# Altium project BLAX_PROD_01_STD_1370_V01.PrjPcb (part 1 of 2)
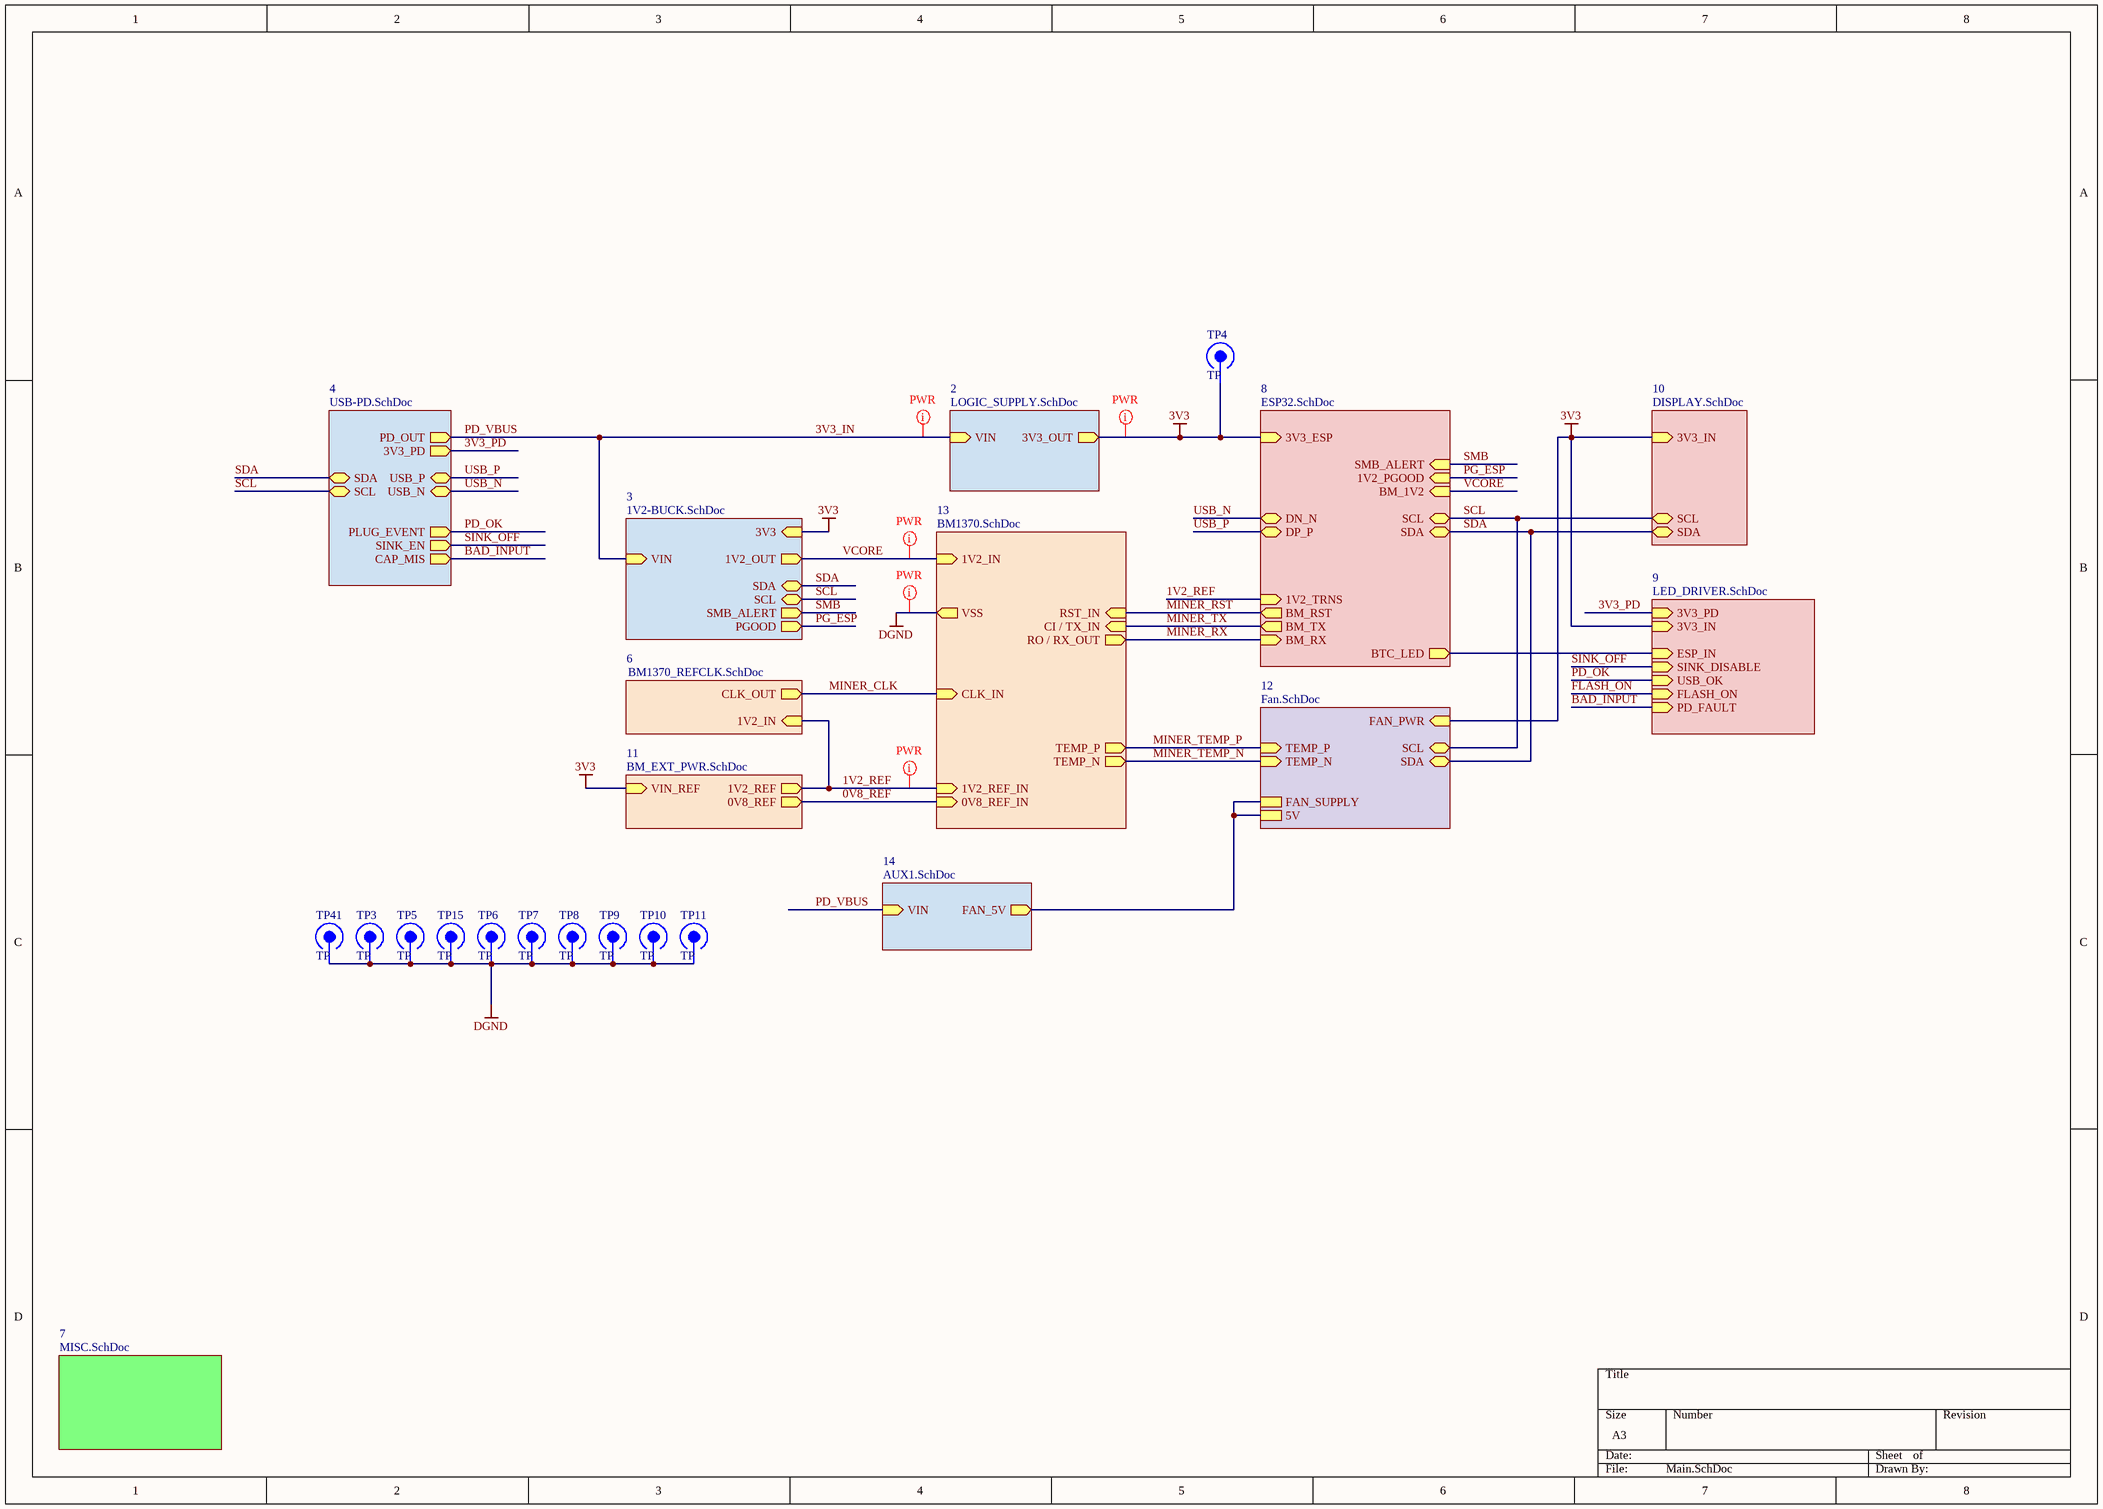
[diagram p0: Main.SchDoc]
13 sheets, 238 parts. Net scope: hierarchical (ports join the sheet entries above them; power ports are global).
Board files: BLU_AX_V1_1_1.PcbDoc, BLU_AX_V1_1_1_FRAME.PcbDoc
Sheets:
  Main.SchDoc
    3 = 1V2-BUCK.SchDoc
    13 = BM1370.SchDoc
    12 = Fan.SchDoc
    4 = USB-PD.SchDoc
    11 = BM_EXT_PWR.SchDoc
    6 = BM1370_REFCLK.SchDoc
    8 = ESP32.SchDoc
    7 = MISC.SchDoc
    2 = LOGIC_SUPPLY.SchDoc
    10 = DISPLAY.SchDoc
    9 = LED_DRIVER.SchDoc
    14 = AUX1.SchDoc

## Sheet Main.SchDoc
size A3; SheetNumber: 1; SheetTotal: 17

### Parts
TP3  TP  [TP-Footprint-1]
TP4  TP  [TP-Footprint-1]
TP5  TP  [TP-Footprint-1]
TP6  TP  [TP-Footprint-1]
TP7  TP  [TP-Footprint-1]
TP8  TP  [TP-Footprint-1]
TP9  TP  [TP-Footprint-1]
TP10  TP  [TP-Footprint-1]
TP11  TP  [TP-Footprint-1]
TP15  TP  [TP-Footprint-1]
TP41  TP  [TP-Footprint-1]

### Sub-sheets
2 = LOGIC_SUPPLY.SchDoc: VIN (in), 3V3_OUT (out)
3 = 1V2-BUCK.SchDoc: VIN (in), 1V2_OUT (out), SDA (bidir), SCL (bidir), SMB_ALERT (out), 3V3 (in), PGOOD (out)
4 = USB-PD.SchDoc: PD_OUT (out), USB_P (bidir), USB_N (bidir), PLUG_EVENT (out), SINK_EN (out), CAP_MIS (out), SDA (bidir), SCL (bidir), 3V3_PD (out)
6 = BM1370_REFCLK.SchDoc: 1V2_IN (in), CLK_OUT (out)
7 = MISC.SchDoc: no entries
8 = ESP32.SchDoc: 3V3_ESP (in), DN_N (bidir), DP_P (bidir), 1V2_PGOOD (in), BM_1V2 (in), SCL (bidir), SDA (bidir), 1V2_TRNS (in), BM_RST (out), BM_TX (out), BM_RX (in), BTC_LED (out), SMB_ALERT (in)
9 = LED_DRIVER.SchDoc: 3V3_IN (in), ESP_IN (in), SINK_DISABLE (in), USB_OK (in), FLASH_ON (in), PD_FAULT (in), 3V3_PD (in)
10 = DISPLAY.SchDoc: 3V3_IN (in), SCL (bidir), SDA (bidir)
11 = BM_EXT_PWR.SchDoc: VIN_REF (in), 1V2_REF (out), 0V8_REF (out)
12 = Fan.SchDoc: SCL (bidir), SDA (bidir), TEMP_P (in), TEMP_N (in), FAN_PWR (in), FAN_SUPPLY, 5V
13 = BM1370.SchDoc: 1V2_REF_IN (in), 0V8_REF_IN (in), 1V2_IN (in), VSS (out), RST_IN (in), CI / TX_IN (in), RO / RX_OUT (out), TEMP_P (out), TEMP_N (out), CLK_IN (in)
14 = AUX1.SchDoc: VIN (in), FAN_5V (out)

### Nets
3V3: TP4.1 ; sheet 3/3V3, sheet 12/FAN_PWR, sheet 11/VIN_REF, sheet 8/3V3_ESP, sheet 2/3V3_OUT, sheet 10/3V3_IN, sheet 9/3V3_IN  [project net 3V3_ESP]
3V3_PD: sheet 4/3V3_PD, sheet 9/3V3_PD
DGND: TP3.1 TP5.1 TP6.1 TP7.1 TP8.1 TP9.1 TP10.1 TP11.1 TP15.1 TP41.1 ; sheet 13/VSS
0V8_REF: sheet 13/0V8_REF_IN, sheet 11/0V8_REF
1V2_REF: sheet 13/1V2_REF_IN, sheet 11/1V2_REF, sheet 6/1V2_IN, sheet 8/1V2_TRNS  [project net 1V2]
3V3_IN: sheet 3/VIN, sheet 4/PD_OUT, sheet 2/VIN, sheet 14/VIN  [also labelled PD_VBUS]
BAD_INPUT: sheet 4/CAP_MIS, sheet 9/PD_FAULT
FLASH_ON: sheet 9/FLASH_ON
FS: sheet 12/FAN_SUPPLY, sheet 12/5V, sheet 14/FAN_5V
MINER_CLK: sheet 13/CLK_IN, sheet 6/CLK_OUT
MINER_RST: sheet 13/RST_IN, sheet 8/BM_RST
MINER_RX: sheet 13/RO / RX_OUT, sheet 8/BM_RX
MINER_TEMP_N: sheet 13/TEMP_N, sheet 12/TEMP_N
MINER_TEMP_P: sheet 13/TEMP_P, sheet 12/TEMP_P
MINER_TX: sheet 13/CI / TX_IN, sheet 8/BM_TX
PD_OK: sheet 4/PLUG_EVENT, sheet 9/USB_OK
PG_ESP: sheet 3/PGOOD, sheet 8/1V2_PGOOD
SCL: sheet 3/SCL, sheet 12/SCL, sheet 4/SCL, sheet 8/SCL, sheet 10/SCL
SDA: sheet 3/SDA, sheet 12/SDA, sheet 4/SDA, sheet 8/SDA, sheet 10/SDA
SINK_OFF: sheet 4/SINK_EN, sheet 9/SINK_DISABLE  [project net SINK_EN]
SMB: sheet 3/SMB_ALERT, sheet 8/SMB_ALERT
USB_N: sheet 4/USB_N, sheet 8/DN_N
USB_P: sheet 4/USB_P, sheet 8/DP_P
VCORE: sheet 3/1V2_OUT, sheet 13/1V2_IN, sheet 8/BM_1V2
NetU5_23: sheet 8/BTC_LED, sheet 9/ESP_IN

### Layout directives
net class PWR: 1V2, 3V3_ESP, 3V3_IN, DGND, VCORE

### Library data of the parts
TP3-TP11 TP15 TP41 = CMP-001-0086-4: digital shovel test point

## Sheet 1V2-BUCK.SchDoc
size A2; SheetNumber: 5; SheetTotal: 17
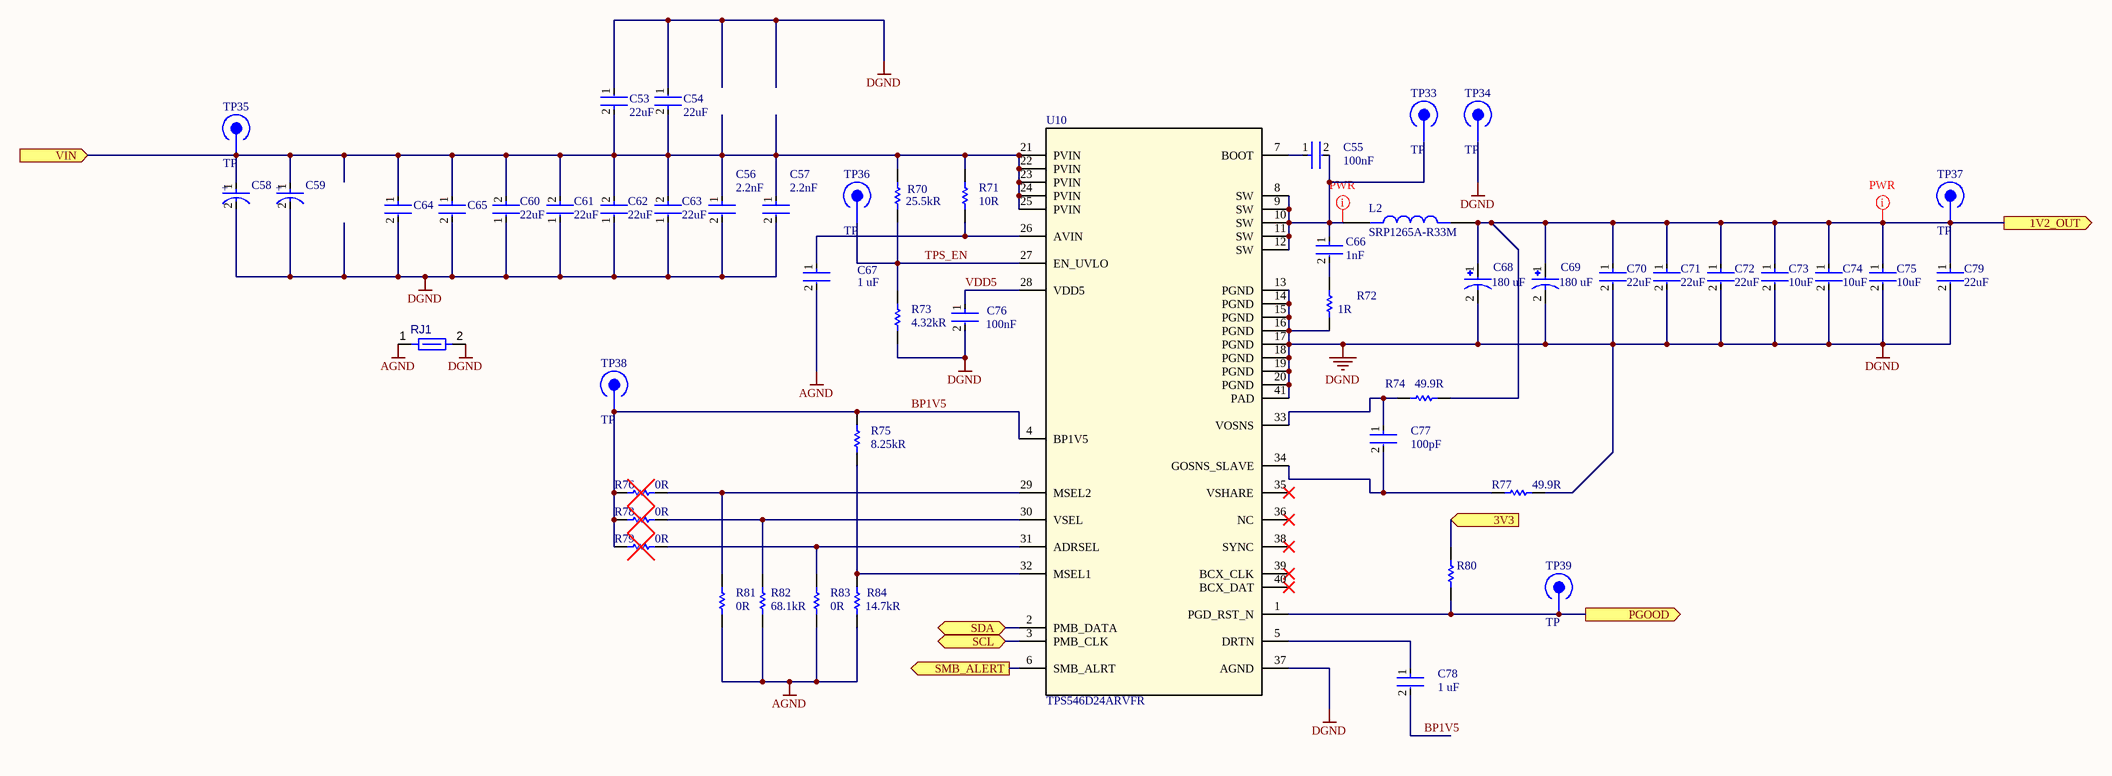
[diagram p1: 1V2-BUCK.SchDoc]

### Parts
C53  Capacitance: 22uF  [FP-GRM31C-0_3-e0_3_0_8-MFG]  (hidden comment: GRM31CC81E226ME11L)
C54  Capacitance: 22uF  [FP-GRM31C-0_3-e0_3_0_8-MFG]  (hidden comment: GRM31CC81E226ME11L)
C55  value 100nF  [FP-CC0402-IPC_B]  (hidden comment: CC0402KRX7R9BB104)
C56  value 2.2nF  [FP-CC0402-MFG]  (hidden comment: CC0402KRX7R8BB222)
C57  value 2.2nF  [FP-CC0402-MFG]  (hidden comment: CC0402KRX7R8BB222)
C58  593D107X9020E2TE3  [593D107X9020E2TE3-Footprint-1]  (value not drawn)
C59  593D107X9020E2TE3  [593D107X9020E2TE3-Footprint-1]  (value not drawn)
C60  Capacitance: 22uF  [FP-GRM31C-0_3-e0_3_0_8-MFG]  (hidden comment: GRM31CC81E226ME11L)
C61  Capacitance: 22uF  [FP-GRM31C-0_3-e0_3_0_8-MFG]  (hidden comment: GRM31CC81E226ME11L)
C62  Capacitance: 22uF  [FP-GRM31C-0_3-e0_3_0_8-MFG]  (hidden comment: GRM31CC81E226ME11L)
C63  Capacitance: 22uF  [FP-GRM31C-0_3-e0_3_0_8-MFG]  (hidden comment: GRM31CC81E226ME11L)
C64  C3216X5R1E476M160AC  [FP-C3216-160-0_2-MFG]  (value not drawn)
C65  C3216X5R1E476M160AC  [FP-C3216-160-0_2-MFG]  (value not drawn)
C66  value 1nF  [FP-CC0805-0_85-MFG]  (hidden comment: CC0805KRX7R9BB102)
C67  value 1 uF  [FP-CC0402-MFG]  (hidden comment: CC0402KRX5R6BB105)
C68  value 180 uF  [EEF-SX0J181ER-Footprint-1]  (hidden comment: EEF-SX0J181ER)
C69  value 180 uF  [EEF-SX0J181ER-Footprint-1]  (hidden comment: EEF-SX0J181ER)
C70  value 22uF  [FP-GRM21B-0_2-e0_2_0_7-MFG]  (hidden comment: GRM21BZ70J226ME44L)
C71  value 22uF  [FP-GRM21B-0_2-e0_2_0_7-MFG]  (hidden comment: GRM21BZ70J226ME44L)
C72  value 22uF  [FP-GRM21B-0_2-e0_2_0_7-MFG]  (hidden comment: GRM21BZ70J226ME44L)
C73  value 10uF  [FP-GRM21B-0_15-MFG]  (hidden comment: GRM21BR71A106KA73L)
C74  value 10uF  [FP-GRM21B-0_15-MFG]  (hidden comment: GRM21BR71A106KA73L)
C75  value 10uF  [FP-GRM21B-0_15-MFG]  (hidden comment: GRM21BR71A106KA73L)
C76  value 100nF  [FP-CC0402-IPC_B]  (hidden comment: CC0402KRX7R9BB104)
C77  value 100pF  [FP-CC0402-MFG]  (hidden comment: CC0402KRX7R9BB101)
C78  value 1 uF  [FP-CC0402-MFG]  (hidden comment: CC0402KRX5R6BB105)
C79  value 22uF  [FP-GRM21B-0_2-e0_2_0_7-MFG]  (hidden comment: GRM21BZ70J226ME44L)
L2  SRP1265A-R33M  [SRP1265A-R33M]
R70  value 25.5kR  [RESC1005X40X25LL10T10]  (hidden comment: RK73H1ETTP2552F)
R71  value 10R  [RESC1005X40X25LL10T10]  (hidden comment: RK73H1ETTP10R0F)
R72  value 1R  [FP-RK73H2E-MFG]  (hidden comment: RK73H2ETTD1R00F)
R73  value 4.32kR  [RESC1005X40X25ML10T10]  (hidden comment: RK73H1ETTP4321F)
R74  value 49.9R  [RESC1005X40X25LL10T10]  (hidden comment: RK73H1ETTP49R9F)
R75  value 8.25kR  [RESC1005X40X25NL10T10]  (hidden comment: RK73H1ETTP8251F)
R76  value 0R  [FP-RK73Z1E-IPC_B]  (hidden comment: RK73Z1ETTP)  (no BOM)
R77  value 49.9R  [RESC1005X40X25LL10T10]  (hidden comment: RK73H1ETTP49R9F)
R78  value 0R  [FP-RK73Z1E-IPC_B]  (hidden comment: RK73Z1ETTP)  (no BOM)
R79  value 0R  [FP-RK73Z1E-IPC_B]  (hidden comment: RK73Z1ETTP)  (no BOM)
R80  RK73H1ETTP1002F  [RESC1005X40X25LL10T10]  (value not drawn)
R81  value 0R  [FP-RK73Z1E-IPC_B]  (hidden comment: RK73Z1ETTP)
R82  value 68.1kR  [RESC1005X40X25LL10T10]  (hidden comment: RK73H1ETTP6812F)
R83  value 0R  [FP-RK73Z1E-IPC_B]  (hidden comment: RK73Z1ETTP)  (no BOM)
R84  value 14.7kR  [RESC1005X40X25LL10T10]  (hidden comment: RK73H1ETTP1472F)
RJ1  Net Tie 12x8mil  [SHORT06-FP]  (value not drawn)  (net tie, no BOM)
TP33  TP  [TP-Footprint-1]
TP34  TP  [TP-Footprint-1]
TP35  TP  [TP-Footprint-1]
TP36  TP  [TP-Footprint-1]
TP37  TP  [TP-Footprint-1]
TP38  TP  [TP-Footprint-1]
TP39  TP  [TP-Footprint-1]
U10  TPS546D24ARVFR  [TPS546D24ARVFR-Footprint-1]

### Ports
1V2_OUT (out), 3V3 (in), PGOOD (out), SCL (bidir), SDA (bidir), SMB_ALERT (out), VIN (in)

### Nets
3V3_ESP: R80.2 ; port 3V3
AGND: C67.2 R81.1 R82.1 R83.1 R84.1 RJ1.1
DGND: C53.1 C54.1 C56.2 C57.2 C58.2(C) C59.2(C) C60.1 C61.1 C62.1 C63.1 C64.2 C65.2 C68.2 C69.2 C70.2 C71.2 C72.2 C73.2 C74.2 C75.2 C76.2 C79.2 R72.1 R73.1 R77.2 RJ1.2 TP34.1 U10.13(PGND) U10.14(PGND) U10.15(PGND) U10.16(PGND) U10.17(PGND) U10.18(PGND) U10.19(PGND) U10.20(PGND) U10.37(AGND) U10.41(PAD)
3V3_IN: C53.2 C54.2 C56.1 C57.1 C58.1(A) C59.1(A) C60.2 C61.2 C62.2 C63.2 C64.1 C65.1 R70.2 R71.2 TP35.1 U10.21(PVIN) U10.22(PVIN) U10.23(PVIN) U10.24(PVIN) U10.25(PVIN) ; port VIN
BP1V5: C78.2 R75.1 R76.2 R78.2 R79.2 TP38.1 U10.4(BP1V5)
PG_ESP: R80.1 TP39.1 U10.1(PGD_RST_N) ; port PGOOD
SCL: U10.3(PMB_CLK) ; port SCL
SDA: U10.2(PMB_DATA) ; port SDA
SMB: U10.6(SMB_ALRT) ; port SMB_ALERT
TPS_EN: R70.1 R73.2 TP36.1 U10.27(EN_UVLO)
VCORE: C68.1 C69.1 C70.1 C71.1 C72.1 C73.1 C74.1 C75.1 C79.1 L2.2 R74.2 TP37.1 ; port 1V2_OUT
VDD5: C76.1 U10.28(VDD5)
NetC55_1: C55.1 U10.7(BOOT)
NetC55_2: C55.2 C66.1 L2.1 TP33.1 U10.8(SW) U10.9(SW) U10.10(SW) U10.11(SW) U10.12(SW)
NetC66_2: C66.2 R72.2
NetC67_1: C67.1 R71.1 U10.26(AVIN)
NetC77_1: C77.1 R74.1 U10.33(VOSNS)
NetC77_2: C77.2 R77.1 U10.34(GOSNS_SLAVE)
NetC78_1: C78.1 U10.5(DRTN)
NetR75_2: R75.2 R84.2 U10.32(MSEL1)
NetR76_1: R76.1 R81.2 U10.29(MSEL2)
NetR78_1: R78.1 R82.2 U10.30(VSEL)
NetR79_1: R79.1 R83.2 U10.31(ADRSEL)

Not connected (* = marked no-connect by the designer): U10 35(VSHARE)* 36(NC)* 38(SYNC)* 39(BCX_CLK)* 40(BCX_DAT)*

### Layout directives
net class PWR: NetC55_2, VCORE

### Notes on the sheet
- (in symbol CMP-001-00321-3) +

### Library data of the parts
C53 C54 C60-C63 = CMP-06035-043516-1: Chip Multilayer Ceramic Capacitors for General Purpose, 1206, 22uF, X6S, 22%, 20%, 25V; Width: 1.6mm; Dielectric: X6S; Thickness: 1.6mm; Length: 3.2mm; Voltage Rating (DC): 25V; Tolerance: 20%
C55 C76 = CMP-x00152-1: Ceramic Capacitor, Multilayer, Ceramic, 50V, 10% +Tol, 10% -Tol, X7R, 15% TC, 0.1uF, Surface Mount, 0402
C56 C57 = CMP-x00156-1: Ceramic Capacitor, Multilayer, Ceramic, 25V, 10% +Tol, 10% -Tol, X7R, 15% TC, 0.0022uF, Surface Mount, 0402
C58 C59 = CMP-001-00321-3: No Description Available; Mfr_Name: Vishay; Pins: 2; Design Item ID: 593D107X9020E2TE3; Source: 593D107X9020E2TE3.SchLib; Component Type: Standard
C64 C65 = CMP-2000-05397-3: Multilayer Ceramic Capacitors 47uF ±20% 25V X5R SMD 1206; Weight: 0.000571oz; Dielectric: X5R; Length: 0.126inch; Voltage Rating: 25V; Case/Package: 1206; Dielectric Material: Ceramic; Min Operating Temperature: -55°C; Lead Free: Lead Free; Packaging: Tape and Reel; Package Quantity: 1; Mount: Surface Mount; Depth: 1.6mm; REACH SVHC: No SVHC; Termination: SMD/SMT; Case Code (Imperial): 1206; Series: C; Resistor Type: Ceramic; Voltage: 25V; Width: 0.063inch; Height: 1.6mm; Tolerance: 20%; Capacitance: 47uF; Max Operating Temperature: 85°C; Voltage Rating (DC): 25V; RoHS Compliant: Yes; Thickness: 0.071inch; Case Code (Metric): 3216
C66 = CMP-x00143-1: Ceramic Capacitor, Multilayer, Ceramic, 50V, 10% +Tol, 10% -Tol, X7R, 15% TC, 0.001uF, Surface Mount, 0805; Category: Capacitor
C67 C78 = CMP-03422-000489-1: CAP CER 1UF 10V X5R 0402; Manufacturer: YAGEO; Temperature Coefficient: 30ppm/°C; Tolerance: 0.1; Automotive Grade: NA; Material: Ceramic; Device Class L1: Passive Components; Ipc Land Pattern Name: CAPC10050X50; Height: 0.55mm; Voltage Rating: 10 V; Digikey Description: CAP CER 1UF 10V X5R 0402; RoHS: TRUE; Temperature: -55°C to +125°C; Octopart: https://octopart.com/cc0402krx5r6bb105-yageo-42244620; Mouser Description: Multilayer Ceramic Capacitors MLCC - SMD/SMT 1uF 10V X5R 10%; Manufacturer Part Number: CC0402KRX5R6BB105; Temperature Characteristic: X5R; Category: Cap; Automotive: No; Temperature Range Low: -55°C; ComponentLink2Description: Datasheet; Temperature Range High: +125°C; Package: CC0402; Capacitance: 1 uF; Footprint Url: http://www.yageo.com/exep/pages/download/literatures/UPY-C_GEN_24.pdf; ComponentLink2URL: http://www.yageo.com/documents/recent/UPY-GP_NP0_16V-to-50V_16.pdf; Lead Free: Yes; Device Class L3: Ceramic Capacitors; Device Class L2: Capacitors
C68 C69 = CMP-x00146-3: Cap Aluminum Polymer 180uF 6.3VDC 20%( 7.3 X 4.3 X 1.9mm) SMD 0.009 Ohm 6300mA 2000h 105C T/R; Manufacturer: Panasonic; Vendor: TTI; Template: PS_SMD2_C; Reel Width: 12mm; MOQ: 3500; Category: Capacitor; Price: 0.531; Package: SMD-2; Mounting: SMD
C70-C72 C79 = CMP-x00148-1: Ceramic Capacitor, Multilayer, Ceramic, 6.3V, 20% +Tol, 20% -Tol, X7R, 15% TC, 22uF, Surface Mount, 0805
C73-C75 = CMP-x00157-1: Ceramic Capacitor, Multilayer, Ceramic, 10V, 10% +Tol, 10% -Tol, X7R, 15% TC, 10uF, Surface Mount, 0805
C77 = CMP-x00153-1: Ceramic Capacitor, Multilayer, Ceramic, 50V, 10% +Tol, 10% -Tol, X7R, 15% TC, 0.0001uF, Surface Mount, 0402
L2 = CMP-00047-01-A-1: General Purpose Inductor, 0.33uH, 20%, 1 Element, Carbonyl Powder-Core, SMD, 5349; Quality Factor-Min (at L-nom): 10; Package Length: 13.5mm; Channels: 1; Package Height: 6.2mm; Shape/Size Description: RECTANGULAR PACKAGE; Reference Standard: AEC-Q200; DC Resistance (DCR): 0.8mR; Inductor Application: POWER INDUCTOR; Max Current Rating: 46A; Case/Size Code: 5349; Shielding: Shielded; Package Width: 12.5mm; Self Resonant Frequency: 90MHz; Test Frequency: 100kHz; Core Material: Carbonyl Powder; Construction: Shielded; Surface Mount: Yes; RoHS Compliant: Yes; Reach SVHC Compliant: Yes; Inductor Type: GENERAL PURPOSE INDUCTOR; Max Operating Temperature: 150°C; Package Style: SMTMeter; Packaging: Tape and Reel; Pins: 2; Min Operating Temperature: -40°C; Inductance-Nom (L): 0.33uH; Termination: Wraparound; Terminal Placement: Dual Ended; Tolerance: 20%
R70 = CMP-x00151-1: BOM UPDATE 25.5K (NEW) RESISTOR FROM 11.7K (OLD) / NEW: RK73H1ETTP2552F
R71 = CMP-x00144-1: Fixed Resistor, Metal Glaze/thick Film, 0.1W, 10ohm, 75V, 1% +/-Tol, 100ppm/Cel, Surface Mount, 0402
R72 = CMP-x00142-1: Fixed Resistor, Metal Glaze/thick Film, 0.5W, 1ohm, 200V, 1% +/-Tol, 200ppm/Cel, Surface Mount, 1210; Manufacturer: KOA Speer; Template: KO_0402; Reel Width: 8mm; Vendor: TTI; Price: 0.03; MOQ: 5000; Category: Resistor; Mounting: SMT; Package: 1210
R73 = CMP-2002-04015-1: BOM UPDATE 4.32K (NEW) RESISTOR FROM 37.4K (OLD) / NEW: RK73H1ETTP4321F; Manufacturer: KOA Speer; Part Number: RK73H1ETTP3741F
R74 R77 = CMP-x00154-1: Fixed Resistor, Metal Glaze/thick Film, 0.1W, 49.9ohm, 75V, 1% +/-Tol, 100ppm/Cel, Surface Mount, 0402
R75 = CMP-2002-04539-1: Manufacturer: KOA Speer; Part Number: RK73H1ETTP8251F
R76 R78 R79 R81 R83 = CMP-x00147-1: Metal Glaze/thick Film, 0ohm, Surface Mount, 0402
R80 = CMP-x00150-1: Fixed Resistor, Metal Glaze/thick Film, 0.1W, 10000ohm, 75V, 1% +/-Tol, 100ppm/Cel, Surface Mount, 0402; Value: 10kR
R82 = CMP-x00145-1: Fixed Resistor, Metal Glaze/thick Film, 0.1W, 68100ohm, 75V, 1% +/-Tol, 100ppm/Cel, Surface Mount, 0402
R84 = CMP-x00149-1: Fixed Resistor, Metal Glaze/thick Film, 0.1W, 14700ohm, 75V, 1% +/-Tol, 100ppm/Cel, Surface Mount, 0402; Category: Resistor
RJ1 = CMP-009-00121-2: Max Operating Temperature: 155°C; Pins: 2; Min Operating Temperature: -55°C
TP33-TP39 = CMP-001-0086-3: digital shovel test point
U10 = CMP-x00141-6: Switching Regulator, Current-mode, 40A, 1500kHz Switching Freq-Max, PQCC40

## Sheet BM1370.SchDoc
size A3; SheetNumber: 4; SheetTotal: 16
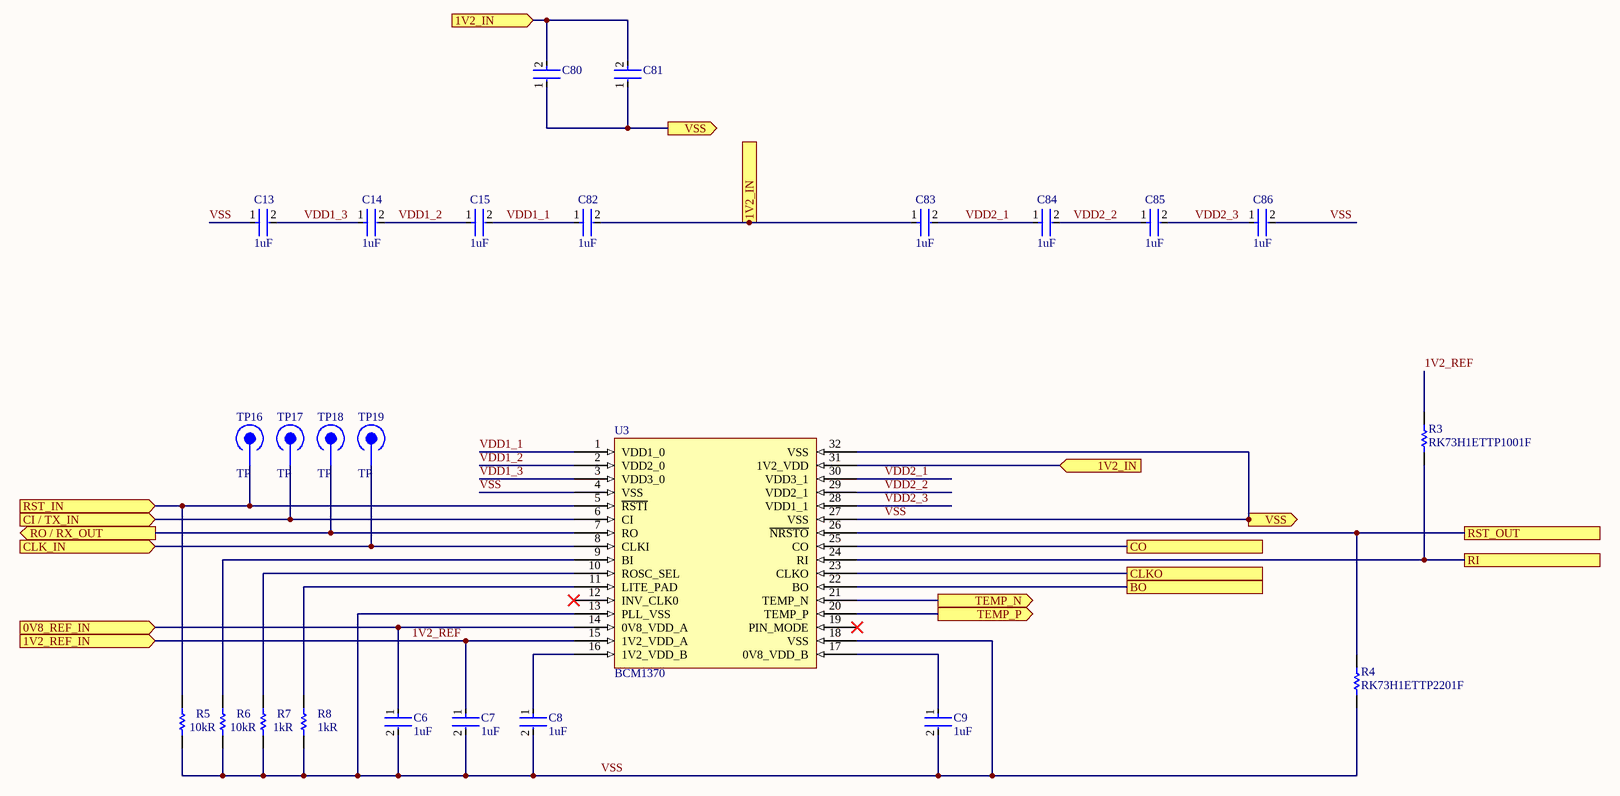
[diagram p2: BM1370.SchDoc]

### Parts
C6  value 1uF  [FP-0402-L_1_0_0_05-W_0_5-MFG]  (hidden comment: EMK105BJ105KV-F)
C7  value 1uF  [FP-0402-L_1_0_0_05-W_0_5-MFG]  (hidden comment: EMK105BJ105KV-F)
C8  value 1uF  [FP-0402-L_1_0_0_05-W_0_5-MFG]  (hidden comment: EMK105BJ105KV-F)
C9  value 1uF  [FP-0402-L_1_0_0_05-W_0_5-MFG]  (hidden comment: EMK105BJ105KV-F)
C13  value 1uF  [FP-0402-L_1_0_0_05-W_0_5-MFG]  (hidden comment: EMK105BJ105KV-F)
C14  value 1uF  [FP-0402-L_1_0_0_05-W_0_5-MFG]  (hidden comment: EMK105BJ105KV-F)
C15  value 1uF  [FP-0402-L_1_0_0_05-W_0_5-MFG]  (hidden comment: EMK105BJ105KV-F)
C80  GRM31CR60J107MEA8K  [FP-GRM31C-0_3-e0_3_0_8-IPC_A]  (value not drawn)
C81  GRM31CR60J107MEA8K  [FP-GRM31C-0_3-e0_3_0_8-IPC_A]  (value not drawn)
C82  value 1uF  [FP-0402-L_1_0_0_05-W_0_5-MFG]  (hidden comment: EMK105BJ105KV-F)
C83  value 1uF  [FP-0402-L_1_0_0_05-W_0_5-MFG]  (hidden comment: EMK105BJ105KV-F)
C84  value 1uF  [FP-0402-L_1_0_0_05-W_0_5-MFG]  (hidden comment: EMK105BJ105KV-F)
C85  value 1uF  [FP-0402-L_1_0_0_05-W_0_5-MFG]  (hidden comment: EMK105BJ105KV-F)
C86  value 1uF  [FP-0402-L_1_0_0_05-W_0_5-MFG]  (hidden comment: EMK105BJ105KV-F)
R3  RK73H1ETTP1001F  [RESC1005X40X25LL10T10]
R4  RK73H1ETTP2201F  [RK73H1ETTP2201F-Footprint-1]
R5  value 10kR  [RESC1005X40X25LL10T10]  (hidden comment: RK73H1ETTP1002F)
R6  value 10kR  [RESC1005X40X25LL10T10]  (hidden comment: RK73H1ETTP1002F)
R7  value 1kR  [RESC1005X40X25LL10T10]  (hidden comment: RK73H1ETTP1001F)
R8  value 1kR  [RESC1005X40X25LL10T10]  (hidden comment: RK73H1ETTP1001F)
TP16  TP  [TP-Footprint-1]
TP17  TP  [TP-Footprint-1]
TP18  TP  [TP-Footprint-1]
TP19  TP  [TP-Footprint-1]
U3  BCM1370  [BCM1370-Footprint-1]

### Ports
0V8_REF_IN (in), 1V2_IN (in), 1V2_REF_IN (in), BO, CI / TX_IN (in), CLK_IN (in), CLKO, CO, RI, RO / RX_OUT (out), RST_IN (in), RST_OUT, TEMP_N (out), TEMP_P (out), VSS (out)

### Nets
VSS: C6.2 C7.2 C8.2 C9.2 C13.1 C80.1 C81.1 C86.2 R4.1 R5.1 R6.1 R7.1 R8.1 U3.4(VSS) U3.13(PLL_VSS) U3.18(VSS) U3.27(VSS) U3.32(VSS) ; port VSS  [project net DGND]
0V8_REF: C6.1 U3.14(0V8_VDD_A) ; port 0V8_REF_IN
1V2_REF: C7.1 R3.2 U3.15(1V2_VDD_A) ; port 1V2_REF_IN  [project net 1V2]
MINER_CLK: TP19.1 U3.8(CLKI) ; port CLK_IN
MINER_RST: R5.2 TP16.1 U3.5(~{RSTI}) ; port RST_IN
MINER_RX: TP18.1 U3.7(RO) ; port RO / RX_OUT
MINER_TEMP_N: U3.21(TEMP_N) ; port TEMP_N
MINER_TEMP_P: U3.20(TEMP_P) ; port TEMP_P
MINER_TX: TP17.1 U3.6(CI) ; port CI / TX_IN
VCORE: C80.2 C81.2 C82.2 C83.1 U3.31(1V2_VDD) ; port 1V2_IN
VDD1_1: C15.2 C82.1 U3.1(VDD1_0)
VDD1_2: C14.2 C15.1 U3.2(VDD2_0)
VDD1_3: C13.2 C14.1 U3.3(VDD3_0)
VDD2_1: C83.2 C84.1 U3.30(VDD3_1)
VDD2_2: C84.2 C85.1 U3.29(VDD2_1)
VDD2_3: C85.2 C86.1 U3.28(VDD1_1)
NetC8_1: C8.1 U3.16(1V2_VDD_B)
NetC9_1: C9.1 U3.17(0V8_VDD_B)
NetR3_1: R3.1 U3.24(RI) ; port RI
NetR4_2: R4.2 U3.26(~{NRSTO}) ; port RST_OUT
NetR6_2: R6.2 U3.9(BI)
NetR7_2: R7.2 U3.10(ROSC_SEL)
NetR8_2: R8.2 U3.11(LITE_PAD)
NetU3_22: U3.22(BO) ; port BO
NetU3_23: U3.23(CLKO) ; port CLKO
NetU3_25: U3.25(CO) ; port CO

Not connected (* = marked no-connect by the designer): U3 12(INV_CLK0)* 19(PIN_MODE)*

### Library data of the parts
C6-C9 C13-C15 C82-C86 = CMP-x00039-4: Ceramic Capacitor, Multilayer, Ceramic, 16V, 10% +Tol, 10% -Tol, X5R, 15% TC, 1uF, Surface Mount, 0402; Manufacturer: Taiyo Yuden; Vendor: TTI; Template: TY_0402; Reel Width: 8mm; Mounting: SMT; Category: Capacitors; MOQ: 10000; Price: 0.000718; Rating: 16V; Package: 0402
C80 C81 = CMP-x00203-1: Ceramic Capacitor, Multilayer, Ceramic, 6.3V, 20% +Tol, 20% -Tol, X5R, 15% TC, 100uF, Surface Mount, 1206; Manufacturer: Murata; Template: MR_1206_C; Package: 1206; Mounting: SMD; Category: Capacitors
R3 = CMP-x00163-1: Fixed Resistor, Metal Glaze/thick Film, 0.1W, 1000ohm, 75V, 1% +/-Tol, 100ppm/Cel, Surface Mount, 0402; Value: 1kR
R4 = CMP-x00008-3: Fixed Resistor, Metal Glaze/thick Film, 0.1W, 2200ohm, 75V, 1% +/-Tol, 100ppm/Cel, Surface Mount, 0402; Manufacturer: KOA Speer; Value: 2.2kΩ; Reel Width: 8mm; Rating: 100mW; Template: KS_0402; Vendor: TTI; Package: 0402; Category: Resistor; Price: 0.00297; MOQ: 10000; Mounting: SMT
R5 R6 = CMP-x00150-1: Fixed Resistor, Metal Glaze/thick Film, 0.1W, 10000ohm, 75V, 1% +/-Tol, 100ppm/Cel, Surface Mount, 0402
R7 R8 = CMP-x00163-1: Fixed Resistor, Metal Glaze/thick Film, 0.1W, 1000ohm, 75V, 1% +/-Tol, 100ppm/Cel, Surface Mount, 0402
TP16-TP19 = CMP-001-0086-3: digital shovel test point
U3 = CMP-x00104-5: BCM1370 Miner Chip; Manufacturer: Bitmain; Template: BM_QFN32; Vendor: -; Reel Width: -; Mounting: SMT; Value: -; Package: QFN32; Category: Integrated Circuit; MOQ: -; Price: -

## Sheet Fan.SchDoc
size A4; SheetNumber: 9; SheetTotal: 16
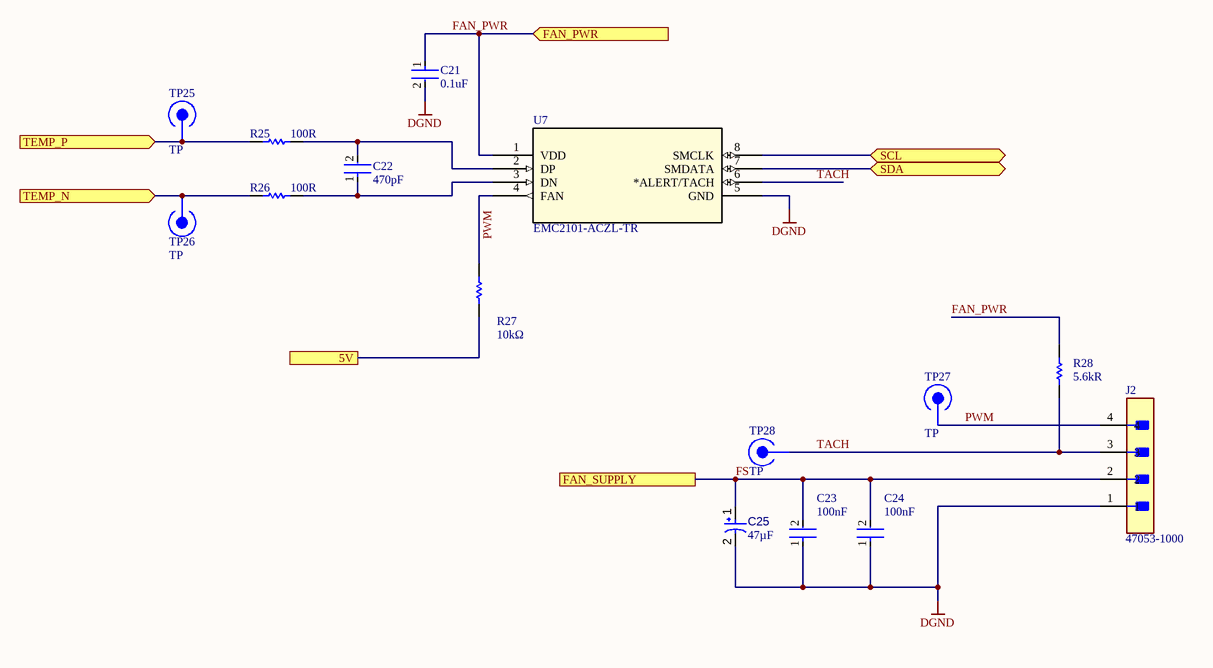
[diagram p3: Fan.SchDoc]

### Parts
C21  value 0.1uF  [FP-CC0402-IPC_C]  (hidden comment: CC0402KRX7R7BB104)
C22  value 470pF  [FP-0402-L_1_0_1-W_0_5_0_1-IPC_C]  (hidden comment: C0402C471K5RACTU)
C23  value 100nF  [FP-CC0402-IPC_B]  (hidden comment: CC0402KRX7R9BB104)
C24  value 100nF  [FP-CC0402-IPC_B]  (hidden comment: CC0402KRX7R9BB104)
C25  value 47µF  [VISH-7343-31_N]  (hidden comment: 293D476X9016D2TE3)
J2  47053-1000  [FP-470531000-MFG]
R25  value 100R  [RESC1005X40X25LL10T10]  (hidden comment: RK73H1ETTP1000F)
R26  value 100R  [RESC1005X40X25LL10T10]  (hidden comment: RK73H1ETTP1000F)
R27  value 10kΩ  [RESC1005X40X25LL10T10]  (hidden comment: RK73B1ETTP103J)
R28  value 5.6kR  [RESC1005X40X25LL10T10]  (hidden comment: RK73H1ETTP5601F)
TP25  TP  [TP-Footprint-1]
TP26  TP  [TP-Footprint-1]
TP27  TP  [TP-Footprint-1]
TP28  TP  [TP-Footprint-1]
U7  EMC2101-ACZL-TR  [EMC2101-ACZL-TR-Footprint-1]

### Ports
5V, FAN_PWR (in), FAN_SUPPLY, SCL (bidir), SDA (bidir), TEMP_N (in), TEMP_P (in)

### Nets
DGND: C21.2 C23.1 C24.1 C25.2 J2.1 U7.5(GND)
FAN_PWR: C21.1 R28.2 U7.1(VDD) ; port FAN_PWR  [project net 3V3_ESP]
FS: C23.2 C24.2 C25.1 J2.2 R27.2 ; port FAN_SUPPLY, port 5V
MINER_TEMP_N: R26.1 TP26.1 ; port TEMP_N
MINER_TEMP_P: R25.1 TP25.1 ; port TEMP_P
PWM: J2.4 R27.1 TP27.1 U7.4(FAN)
SCL: U7.8(SMCLK) ; port SCL
SDA: U7.7(SMDATA) ; port SDA
TACH: J2.3 R28.1 TP28.1 U7.6(*ALERT/TACH)
NetC22_1: C22.1 R26.2 U7.3(DN)
NetC22_2: C22.2 R25.2 U7.2(DP)

### Library data of the parts
C21 = CMP-001-00094-1: Multilayer Ceramic Capacitor, 0.1 uF, 25 V, ± 10%, X7R, 0402 [1005 Metric]; Rating: 16V; Reel Size: 8mm; Vendor: TTI; Category: Capacitor; Price: 0.004; Package: 0402; MOQ: 10000
C22 = CMP-001-00097-1: CAPACITOR - Ceramic Chip Cap, 0402, 470 pf, 10%, 50V, X7R; Reel Size: 8mm; Vendor: TTI; Price: 0.003; MOQ: 10000; Package: 0402; Category: Capacitor; Rating: 50V
C23 C24 = CMP-x00152-1: as C55 on sheet 1V2-BUCK
C25 = CMP-001-00022-7: Solid Tantalum Chip Capacitor, 47 uF, +/- 10%, 16 V, -55 to 125 degC, 2917 (7343 Metric), RoHS, Tape and Reel; Manufacturer: Vishay Semiconductor; Voltage Rating: 16V; Datasheet URL: http://www.vishay.com/docs/40002/293d.pdf; Max Operating Temperature: 125°C; Packaging: TapeandReel; Mounting Technology: SM; Capacitor Type: Tantalum; Tolerance: 10%; Min Operating Temperature: -55°C; Package Reference: 7343-31; RoHS Compliant: Unknown; Manufacturer URL: http://www.vishay.com/; Datasheet Version: Aug-16; Package Description: 2-Pin Surface Mount Device, Body 7.3 x 4.3 mm; Case/Package: 7343-31
J2 = CMP-04776-000290-2: CONN HEADER VERT 4POS 2.54MM; NexarPartId: 854935; Manufacturer Lifecycle Status: ACTIVE; Voltage Rating (DC): 250V; Gender: Male; Plating: Copper; Number of Positions: 4; Glow Wire Compliant: Non-compliant; Current Rating: 500mA; Max Operating Temperature: 75°C; Number of Rows: 1; REACH SVHC: Unknown; Ambient Temperature Range High: 105°C; Pitch: 2.54mm; Height: 7.7mm; Min Operating Temperature: 0°C; Packaging: Bulk; Contact Material: Brass, Copper; Contact Plating: Tin; Lead Pitch: 2.54mm; Voltage Rating: 250V; Termination: Through Hole; Radiation Hardening: No; Orientation: Vertical; Mount: Through Hole; Number of Pins: 4; Country of Origin: HK; Halogen Free: Low Halogen; Lifecycle Status: Production; Number of Circuits: 4; Schedule B: 8536694040, 8536694040; Housing Color: Beige; Housing Material: Nylon; Depth: 5.84mm; RoHS: Compliant; Length: 10.2mm; Number of Contacts: 4
R25 R26 = CMP-x00174-1: Fixed Resistor, Metal Glaze/thick Film, 0.1W, 100ohm, 75V, 1% +/-Tol, 100ppm/Cel, Surface Mount, 0402
R27 = CMP-009-00227-1: Fixed Resistor, Metal Glaze/thick Film, 0.1W, 10000ohm, 75V, 5% +/-Tol, 200ppm/Cel, Surface Mount, 0402; Rating: 1/10W; Vendor: TTI; Package: 0402; Price: 0.0017; Category: Resistor
R28 = CMP-x00164-1: Fixed Resistor, Metal Glaze/thick Film, 0.1W, 5600ohm, 75V, 1% +/-Tol, 100ppm/Cel, Surface Mount, 0402
TP25-TP28 = CMP-001-0086-3: digital shovel test point
U7 = CMP-x00137-1: Serial Switch/Digital Sensor, 11 Bit(s), 2Cel, Square, Surface Mount; Manufacturer: Microchip; Reel Width: 8mm; Template: MC_TSSOP_8; Vendor: Mouser; Mounting: SMT; Package: TSSOP_8; Category: Integrated Circuit; Price: 1.62; MOQ: 1

## Sheet USB-PD.SchDoc
size A2; SheetNumber: 2; SheetTotal: 17
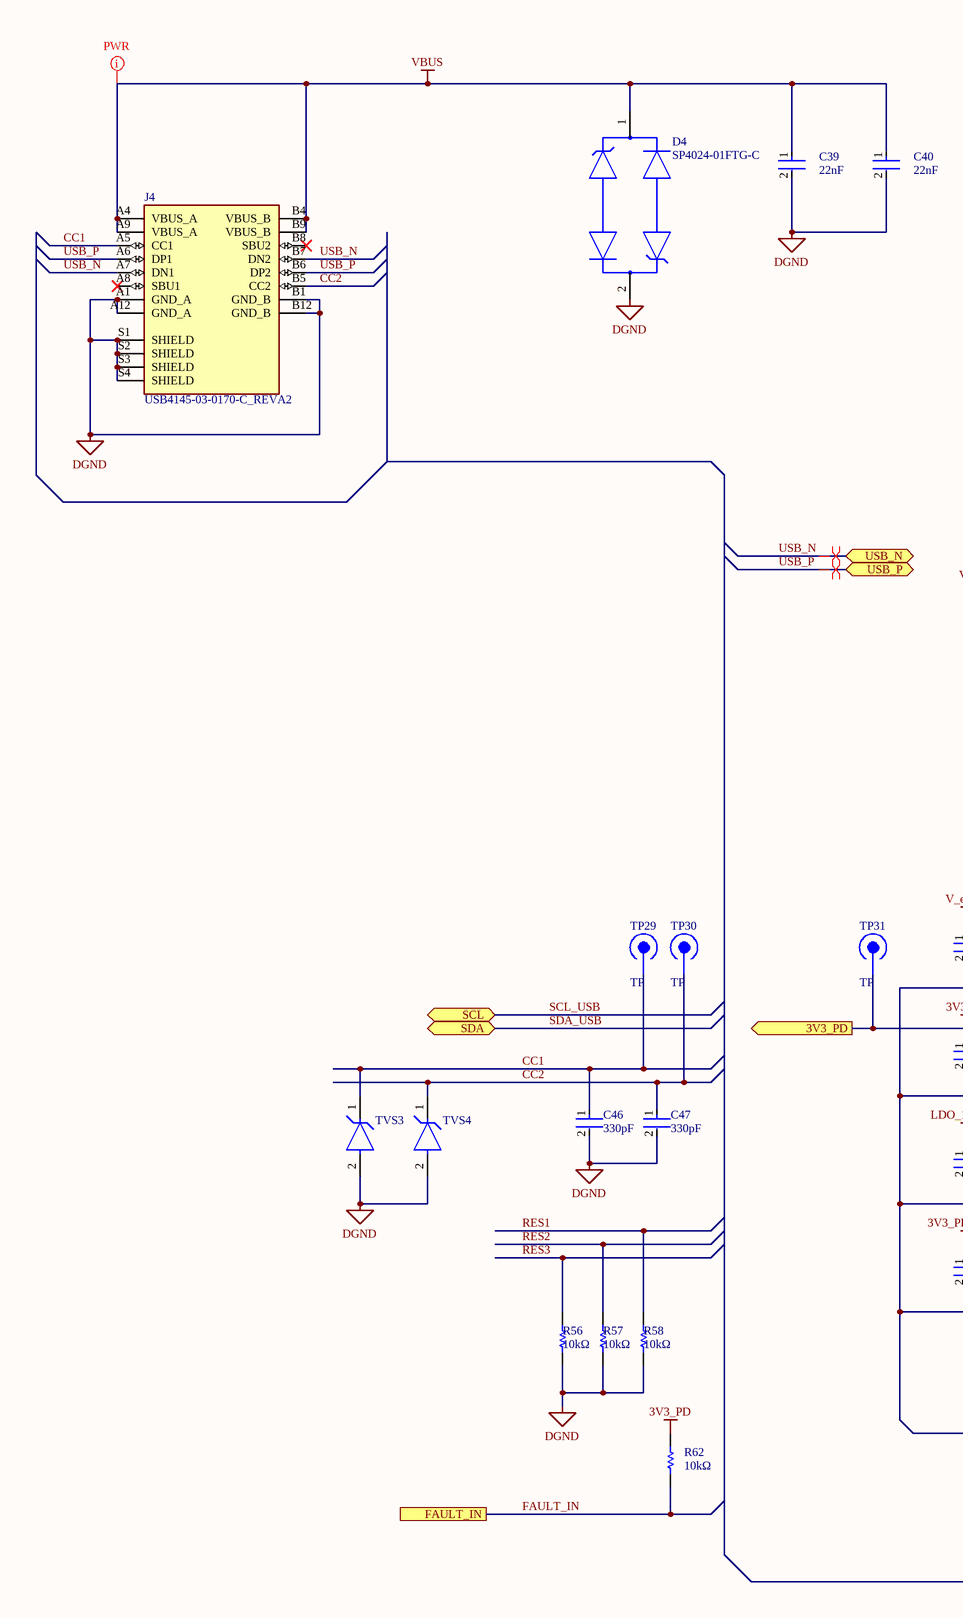
[diagram p4: USB-PD.SchDoc, left]
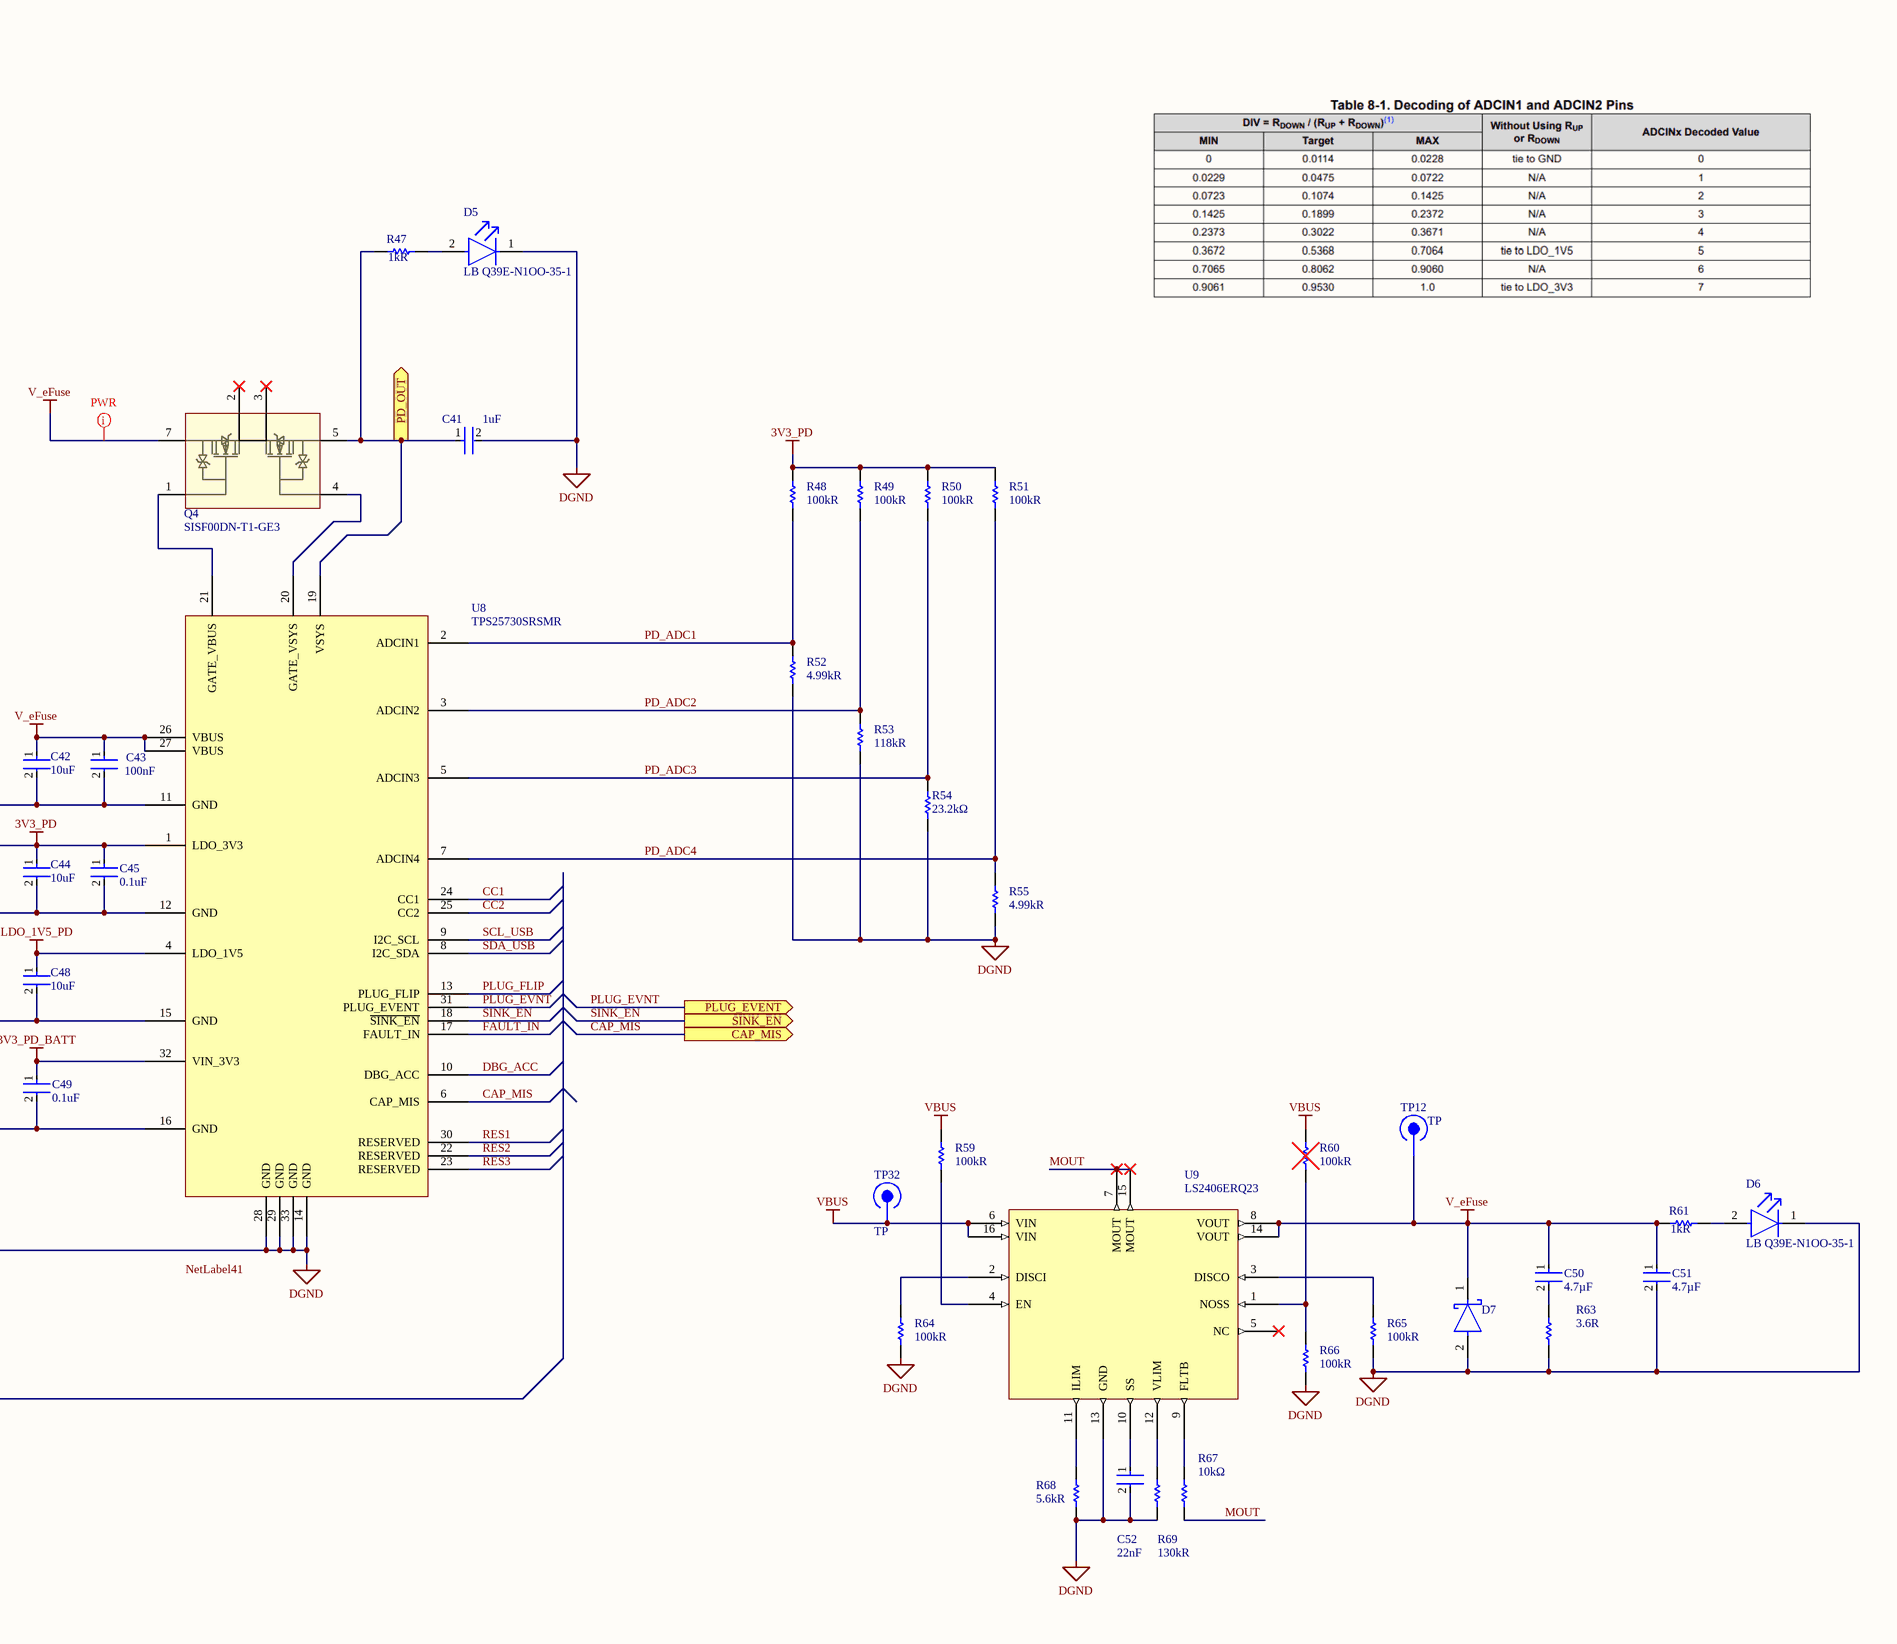
[diagram p5: USB-PD.SchDoc, right]

### Parts
C39  value 22nF  [FP-GRM155-0_05-MFG]  (hidden comment: GRM155R71H223KA12D)
C40  value 22nF  [FP-GRM155-0_05-MFG]  (hidden comment: GRM155R71H223KA12D)
C41  value 1uF  [FP-GCM188-0_1-IPC_B]  (hidden comment: GCM188R71E105KA64J)
C42  value 10uF  [FP-GRM155-0_2-MFG]  (hidden comment: GRM155R61A106ME11D)
C43  value 100nF  [FP-CC0402-IPC_B]  (hidden comment: CC0402KRX7R9BB104)
C44  value 10uF  [FP-GRM155-0_2-MFG]  (hidden comment: GRM155R61A106ME11D)
C45  value 0.1uF  [FP-CC0402-IPC_C]  (hidden comment: CC0402KRX7R7BB104)
C46  value 330pF  [FP-C0402-BB-MFG]  (hidden comment: C0402C331K5RACTU)
C47  value 330pF  [FP-C0402-BB-MFG]  (hidden comment: C0402C331K5RACTU)
C48  value 10uF  [FP-GRM155-0_2-MFG]  (hidden comment: GRM155R61A106ME11D)
C49  value 0.1uF  [FP-CC0402-IPC_C]  (hidden comment: CC0402KRX7R7BB104)
C50  value 4.7µF  [FP-GRM21B-0_15-IPC_A]  (hidden comment: GRM21BR61H475KE51L)
C51  value 4.7µF  [FP-GRM21B-0_15-IPC_A]  (hidden comment: GRM21BR61H475KE51L)
C52  value 22nF  [FP-GRM155-0_05-MFG]  (hidden comment: GRM155R71H223KA12D)
D4  SP4024-01FTG-C  [FP-SP4024-CA-MFG]
D5  LB Q39E-N1OO-35-1  [FP-LB_Q39E-MFG]
D6  LB Q39E-N1OO-35-1  [FP-LB_Q39E-MFG]
D7  PMEG4030ER,115  [FP-SOD123W-MFG]  (value not drawn)
J4  USB4145-03-0170-C_REVA2  [GCT_USB4145-03-0170-C_REVA2]
Q4  SISF00DN-T1-GE3  [New footprint 1]
R47  value 1kR  [FP-ERA2A-MFG]  (hidden comment: ERA-2AEB102X)
R48  value 100kR  [RESC1005X40X25LL10T10]  (hidden comment: RK73H1ETTP1003F)
R49  value 100kR  [RESC1005X40X25LL10T10]  (hidden comment: RK73H1ETTP1003F)
R50  value 100kR  [RESC1005X40X25LL10T10]  (hidden comment: RK73H1ETTP1003F)
R51  value 100kR  [RESC1005X40X25LL10T10]  (hidden comment: RK73H1ETTP1003F)
R52  value 4.99kR  [RESC1005X40X25LL10T10]  (hidden comment: RK73H1ETTP4991F)
R53  value 118kR  [RESC1005X40X25LL10T10]  (hidden comment: RK73H1ETTP1183F)
R54  value 23.2kΩ  [RESC1005X40X25LL10T10]  (hidden comment: RK73H1ETTP2322F)
R55  value 4.99kR  [RESC1005X40X25LL10T10]  (hidden comment: RK73H1ETTP4991F)
R56  value 10kΩ  [RESC1005X40X25LL10T10]  (hidden comment: RK73B1ETTP103J)
R57  value 10kΩ  [RESC1005X40X25LL10T10]  (hidden comment: RK73B1ETTP103J)
R58  value 10kΩ  [RESC1005X40X25LL10T10]  (hidden comment: RK73B1ETTP103J)
R59  value 100kR  [RESC1005X40X25LL10T10]  (hidden comment: RK73H1ETTP1003F)
R60  value 100kR  [RESC1005X40X25LL10T10]  (hidden comment: RK73H1ETTP1003F)  (no BOM)
R61  value 1kR  [FP-ERA2A-MFG]  (hidden comment: ERA-2AEB102X)
R62  value 10kΩ  [RESC1005X40X25LL10T10]  (hidden comment: RK73B1ETTP103J)
R63  value 3.6R  [FP-RK73H2A-MFG]  (hidden comment: RK73H2ATTD3R60F)
R64  value 100kR  [RESC1005X40X25LL10T10]  (hidden comment: RK73H1ETTP1003F)
R65  value 100kR  [RESC1005X40X25LL10T10]  (hidden comment: RK73H1ETTP1003F)
R66  value 100kR  [RESC1005X40X25LL10T10]  (hidden comment: RK73H1ETTP1003F)
R67  value 10kΩ  [RESC1005X40X25LL10T10]  (hidden comment: RK73B1ETTP103J)
R68  value 5.6kR  [RESC1005X40X25LL10T10]  (hidden comment: RK73H1ETTP5601F)
R69  value 130kR  [RESC1005X40X25NL10T10]  (hidden comment: RK73H1ETTP1303F)
TP12  TP  [TP-Footprint-1]
TP29  TP  [TP-Footprint-1]
TP30  TP  [TP-Footprint-1]
TP31  TP  [TP-Footprint-1]
TP32  TP  [TP-Footprint-1]
TVS3  PESD5Z5.0,115  [DIO_BAS716,115]  (value not drawn)
TVS4  PESD5Z5.0,115  [DIO_BAS716,115]  (value not drawn)
U8  TPS25730SRSMR  [QFN40P400X400X100_HS-33N]
U9  LS2406ERQ23  [LS2406ERQ23-Footprint-1]

### Ports
3V3_PD (out), CAP_MIS (out), FAULT_IN, PD_OUT (out), PLUG_EVENT (out), SCL (bidir), SDA (bidir), SINK_EN (out), USB_N (bidir), USB_P (bidir)

### Nets
3V3_PD: C44.1 C45.1 R48.2 R49.2 R50.2 R51.2 R62.2 TP31.1 U8.1(LDO_3V3) ; port 3V3_PD
3V3_PD_BATT: C49.1 U8.32(VIN_3V3)
DGND: C39.2 C40.2 C41.2 C42.2 C43.2 C44.2 C45.2 C46.2 C47.2 C48.2 C49.2 C51.2 C52.2 D4.2 D5.1(C) D6.1(C) D7.2(A) J4.A1(GND_A) J4.A12(GND_A) J4.B1(GND_B) J4.B12(GND_B) J4.S1(SHIELD) J4.S2(SHIELD) J4.S3(SHIELD) J4.S4(SHIELD) R52.1 R53.1 R54.1 R55.1 R56.1 R57.1 R58.1 R63.1 R64.1 R65.1 R66.1 R68.1 R69.1 TVS3.2 TVS4.2 U8.11(GND) U8.12(GND) U8.14(GND) U8.15(GND) U8.16(GND) U8.28(GND) U8.29(GND) U8.33(GND) U9.13(GND)
LDO_1V5_PD: C48.1 U8.4(LDO_1V5)
V_eFuse: C42.1 C43.1 C50.1 C51.1 D7.1(C) Q4.7(S1) R61.2 TP12.1 U8.26(VBUS) U8.27(VBUS) U9.8(VOUT) U9.14(VOUT)
VBUS: C39.1 C40.1 D4.1 J4.A4(VBUS_A) J4.A9(VBUS_A) J4.B4(VBUS_B) J4.B9(VBUS_B) R59.2 R60.2 TP32.1 U9.6(VIN) U9.16(VIN)
3V3_IN: C41.1 Q4.5(S2) R47.2 U8.19(VSYS) ; port PD_OUT
CAP_MIS: U8.6(CAP_MIS) ; port CAP_MIS  [project net BAD_INPUT]
CC1: C46.1 J4.A5(CC1) TP29.1 TVS3.1 U8.24(CC1)
CC2: C47.1 J4.B5(CC2) TP30.1 TVS4.1 U8.25(CC2)
DBG_ACC: U8.10(DBG_ACC)
FAULT_IN: R62.1 U8.17(FAULT_IN) ; port FAULT_IN
MOUT: R67.1 U9.7(MOUT) U9.15(MOUT)
PD_ADC1: R48.1 R52.2 U8.2(ADCIN1)
PD_ADC2: R49.1 R53.2 U8.3(ADCIN2)
PD_ADC3: R50.1 R54.2 U8.5(ADCIN3)
PD_ADC4: R51.1 R55.2 U8.7(ADCIN4)
PLUG_EVNT: U8.31(PLUG_EVENT) ; port PLUG_EVENT  [project net PD_OK]
PLUG_FLIP: U8.13(PLUG_FLIP)
RES1: R58.2 U8.30(RESERVED)
RES2: R57.2 U8.22(RESERVED)
RES3: R56.2 U8.23(RESERVED)
SCL_USB: U8.9(I2C_SCL) ; port SCL  [project net SCL]
SDA_USB: U8.8(I2C_SDA) ; port SDA  [project net SDA]
SINK_EN: U8.18(~{SINK_EN}) ; port SINK_EN
USB_N: J4.A7(DN1) J4.B7(DN2) ; port USB_N
USB_P: J4.A6(DP1) J4.B6(DP2) ; port USB_P
NetC50_2: C50.2 R63.2
NetC52_1: C52.1 U9.10(SS)
NetD5_2: D5.2(A) R47.1
NetD6_2: D6.2(A) R61.1
NetQ4_1: Q4.1(G1) U8.21(GATE_VBUS)
NetQ4_4: Q4.4(G2) U8.20(GATE_VSYS)
NetR59_1: R59.1 U9.4(EN)
NetR60_1: R60.1 R66.2 U9.1(NOSS)
NetR64_2: R64.2 U9.2(DISCI)
NetR65_2: R65.2 U9.3(DISCO)
NetR67_2: R67.2 U9.9(FLTB)
NetR68_2: R68.2 U9.11(ILIM)
NetR69_2: R69.2 U9.12(VLIM)

Not connected (* = marked no-connect by the designer): J4 A8(SBU1)* B8(SBU2)*; Q4 2(S1)* 3(S1)*; U9 5(NC)*

### Layout directives
net class PWR: V_eFuse, VBUS
differential pair; differential pair class USB90_DIFF: USB_N, USB_P

### Notes on the sheet
- Labels drawn without touching a wire or pin: NetLabel41

### Library data of the parts
C39 C40 C52 = CMP-x00115-1: Ceramic Capacitor, Multilayer, Ceramic, 50V, 10% +Tol, 10% -Tol, X7R, 15% TC, 0.022uF, Surface Mount, 0402; Manufacturer: Murata; Vendor: TTI; Template: MR_0402; Reel Width: 8mm; MOQ: 10000; Category: Capacitor; Package: 0402; Price: 0.00395; Mounting: SMT
C41 = CMP-x00092-1: Ceramic Capacitor, Multilayer, Ceramic, 25V, 10% +Tol, 10% -Tol, X7R, 15% TC, 1uF, Surface Mount, 0603; Manufacturer: Murata; Vendor: TTI; Template: MR_1608; Reel Width: 8mm; Package: 1608; Category: Capacitors; Price: 0.0268; MOQ: 50000; Mounting: SMT
C42 C44 C48 = CMP-x00183-1: Ceramic Capacitor, Multilayer, Ceramic, 10V, 20% +Tol, 20% -Tol, X5R, 15% TC, 10uF, Surface Mount, 0402
C43 = CMP-x00152-1: as C55 on sheet 1V2-BUCK
C45 C49 = CMP-001-00094-1: as C21 on sheet Fan; Category: Capacitor; Price: 0.004; Package: 0402; MOQ: 10000
C46 C47 = CMP-x00111-1: Ceramic Capacitor, Multilayer, Ceramic, 50V, 10% +Tol, 10% -Tol, X7R, 15% TC, 0.00033uF, Surface Mount, 0402; Manufacturer: Kemet; Vendor: TTI; Template: KM_0402; Reel Width: 8mm; Mounting: SMT; Price: 0.003; MOQ: 10000; Category: Capacitor; Package: 0402
C50 C51 = CMP-001-00268-1: Ceramic Capacitor, Multilayer, Ceramic, 50V, 10% +Tol, 10% -Tol, X5R, 15% TC, 4.7uF, Surface Mount, 0805; Mounting Technology: Surface Mount; Pins: 2; Min Operating Temperature: -55°C; Max Operating Temperature: 85°C; Case/Package: 0805; Capacitor Type: Ceramic; RoHS Compliant: Yes
D4 = CMP-x00114-1: Trans Voltage Suppressor Diode, 350W, 24V V(RWM), Bidirectional, 1 Element, Silicon; Manufacturer: Littelfuse; Reel Width: 8mm; Vendor: TTI; Template: LF_SOD_323; Package: SOD_323_2; Category: TVS Dioded; MOQ: 3000; Value: 24V; Mounting: SMT; Price: 0.165
D5 D6 = CMP-62016-000029-1: LED BLUE DIFFUSED 0603 SMD; Lens Color: White; Viewing Angle: 130°; Dominant Wavelength: 470nm; Lens Style: Flat; Luminous Intensity: 42mcd; Forward Voltage: 2.85V; Test Current: 5mA; Number of LEDs: 1; Lens Size: 0.8mm; Luminous Flux: 0.13lm; Case/Package: 0603; Lens Transparency: Diffused; Case Code (Imperial): 0603; Width: 0.8mm; Height: 0.4mm; Color: Blue; Mount: Surface Mount; Packaging: Tape and Reel; Number of Pins: 2; Length: 1.6mm; Radiation Hardening: No; Case Code (Metric): 1608
D7 = CMP-x00083-1: Rectifier Diode, Schottky, 1 Phase, 1 Element, 3A, 40V V(RRM), Silicon; Manufacturer: Nexperia; Vendor: TTI; Template: NX_SOD_123W_2; Reel Width: 8mm; Category: Diodes; Package: SOD-123W-2; MOQ: 3000; Value: 3A; Mounting: SMT; Price: 0.072
J4 = CMP-349-000000-01-A-2: Value: *; Availability: Unavailable; Pin Count: 20; Price: None; Package: None; Source: USB4145-03-0170-C_REVA2.SchLib; Design Item ID: USB4145-03-0170-C_REVA2; Component Type: Standard; MP: USB4145-03-0170-C_REVA2
Q4 = CMP-x00106-2: Power Field-Effect Transistor; Manufacturer: Vishay; Vendor: TTI; Template: VS_PP12_8; Value: 30V; Reel Width: 12mm; Category: Integrated Circuit; Package: PP12-8; Price: 0.544; MOQ: 3000; Mounting: SMT
R47 R61 = CMP-x00015-3: Fixed Resistor, Thin Film, 0.063W, 1000ohm, 50V, 0.1% +/-Tol, 25ppm/Cel, Surface Mount, 0402; Manufacturer: Panasonic; Rating: 63mW; Vendor: TTI; Reel Width: 8mm; Template: PS_0402; Price: 0.0357; Category: Resistor; MOQ: 10000; Mounting: SMT; Package: 0402
R48-R51 R59 R60 R64-R66 = CMP-x00162-1: Fixed Resistor, Metal Glaze/thick Film, 0.1W, 100000ohm, 75V, 1% +/-Tol, 100ppm/Cel, Surface Mount, 0402
R52 R55 = CMP-x00172-1: Fixed Resistor, Metal Glaze/thick Film, 0.1W, 4990ohm, 75V, 1% +/-Tol, 100ppm/Cel, Surface Mount, 0402
R53 = CMP-x00173-1: Fixed Resistor, Metal Glaze/thick Film, 0.1W, 118000ohm, 75V, 1% +/-Tol, 100ppm/Cel, Surface Mount, 0402
R54 = CMP-009-00229-1: Fixed Resistor, Metal Glaze/thick Film, 0.1W, 23200ohm, 75V, 1% +/-Tol, 100ppm/Cel, Surface Mount, 0402; Vendor: TTI; Rating: 1/10W; Category: Resistor; Package: 0402; Price: 0.00295
R56-R58 R62 R67 = CMP-009-00227-1: as R27 on sheet Fan; Package: 0402; Price: 0.0017; Category: Resistor
R63 = CMP-x00167-1: Fixed Resistor, Metal Glaze/thick Film, 0.25W, 3.6ohm, 150V, 1% +/-Tol, 200ppm/Cel, Surface Mount, 0805
R68 = CMP-x00164-1: as R28 on sheet Fan
R69 = CMP-2002-03957-1: Manufacturer: KOA Speer; Part Number: RK73H1ETTP1303F
TP12 TP29-TP32 = CMP-001-0086-3: digital shovel test point
TVS3 TVS4 = CMP-x00209-4: Trans Voltage Suppressor Diode, 180W, 5V V(RWM), Unidirectional, 1 Element, Silicon; Manufacturer: Nexperia; Template: NX_SOD_523_2; Mounting: SMD; Category: Diodes; Package: SOD_523_2
U8 = CMP-x00105-1: Sink-only USB Type-C® and USB Power Delivery (PD) controller with no firmware development required 32-VQFN -40 to 125; Manufacturer: Texas Instruments; Template: TI_VQFN_32; Reel Width: 12mm; Category: Integrated Circuit; Mounting: SMT; Package: 32-VQFN; Value: -; Price: 0.8; MOQ: 1000; Vendor: Texas Instruments
U9 = CMP-x00113-1: 28V/6A Efuse With True Rcb & Frs; Manufacturer: Littelfuse; Reel Width: 12mm; Template: LF_QFN_16; Vendor: TTI; Category: Integrated Circuit; Mounting: SMT; Package: QFN_16; MOQ: 5000; Price: 1.37; Value: -

## Sheet BM_EXT_PWR.SchDoc
size A4; SheetNumber: 6; SheetTotal: 15
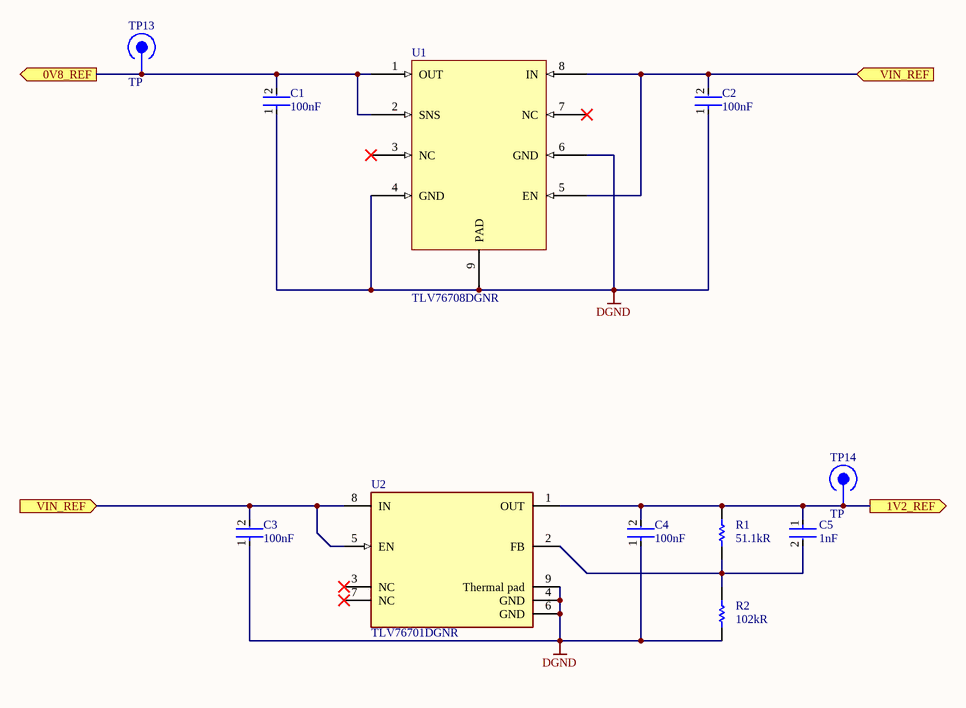
[diagram p6: BM_EXT_PWR.SchDoc]

### Parts
C1  value 100nF  [FP-CC0402-IPC_B]  (hidden comment: CC0402KRX7R9BB104)
C2  value 100nF  [FP-CC0402-IPC_B]  (hidden comment: CC0402KRX7R9BB104)
C3  value 100nF  [FP-CC0402-IPC_B]  (hidden comment: CC0402KRX7R9BB104)
C4  value 100nF  [FP-CC0402-IPC_B]  (hidden comment: CC0402KRX7R9BB104)
C5  value 1nF  [FP-CC0805-0_85-MFG]  (hidden comment: CC0805KRX7R9BB102)
R1  value 51.1kR  [RESC1005X40X25LL10T10]  (hidden comment: RK73H1ETTP5112F)
R2  value 102kR  [RESC1005X40X25LL10T10]  (hidden comment: RK73H1ETTP1023F)
TP13  TP  [TP-Footprint-1]
TP14  TP  [TP-Footprint-1]
U1  TLV76708DGNR  [TLV76708DGNR-Footprint-1]
U2  TLV76701DGNR  [FP-DGN0008G-MFG]

### Ports
0V8_REF (out), 1V2_REF (out), VIN_REF (in)

### Nets
3V3_ESP: C2.2 C3.2 U1.5(EN) U1.8(IN) U2.5(EN) U2.8(IN) ; port VIN_REF
DGND: C1.1 C2.1 C3.1 C4.1 R2.1 U1.4(GND) U1.6(GND) U1.9(PAD) U2.4(GND) U2.6(GND) U2.9(Thermal_pad)
0V8_REF: C1.2 TP13.1 U1.1(OUT) U1.2(SNS) ; port 0V8_REF
1V2: C4.2 C5.1 R1.2 TP14.1 U2.1(OUT) ; port 1V2_REF
NetC5_2: C5.2 R1.1 R2.2 U2.2(FB)

Not connected (* = marked no-connect by the designer): U1 3(NC)* 7(NC)*; U2 3(NC)* 7(NC)*

### Library data of the parts
C1-C4 = CMP-x00152-1: as C55 on sheet 1V2-BUCK
C5 = CMP-x00143-1: as C66 on sheet 1V2-BUCK; Category: Capacitor
R1 = CMP-x00159-1: Fixed Resistor, Metal Glaze/thick Film, 0.1W, 51100ohm, 75V, 1% +/-Tol, 100ppm/Cel, Surface Mount, 0402
R2 = CMP-x00160-1: Fixed Resistor, Metal Glaze/thick Film, 0.1W, 102000ohm, 75V, 1% +/-Tol, 100ppm/Cel, Surface Mount, 0402
TP13 TP14 = CMP-001-0086-3: digital shovel test point
U1 = CMP-x00161-1: Adjustable- and fixed-output, 1-A, 16-V, positive-voltage low-dropout (LDO) linear regulator 8-HVSSOP -40 to 125
U2 = CMP-x00158-1: Adjustable Positive Standard Regulator, 0.8V Min, 13.6V Max, PDSO8

## Sheet BM1370_REFCLK.SchDoc
size A4; SheetNumber: 8; SheetTotal: 15
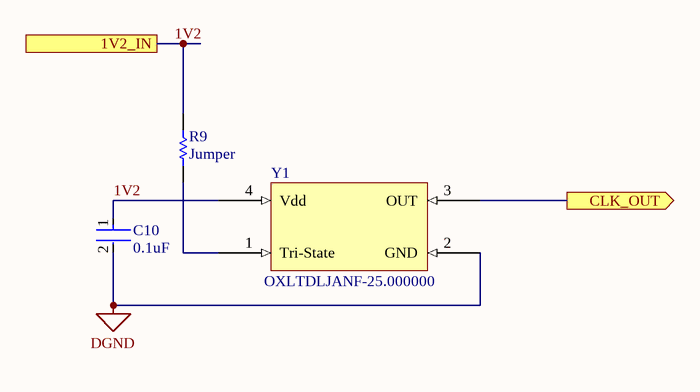
[diagram p7: BM1370_REFCLK.SchDoc]

### Parts
C10  value 0.1uF  [FP-CC0402-IPC_C]  (hidden comment: CC0402KRX7R7BB104)
R9  value Jumper  [FP-RK73Z1E-IPC_B]  (hidden comment: RK73Z1ETTP)
Y1  OXLTDLJANF-25.000000  [OXLTDLJANF-25.000000-Footprint-1]

### Ports
1V2_IN, CLK_OUT (out)

### Nets
DGND: C10.2 Y1.2(GND)
1V2: C10.1 R9.2 Y1.4(Vdd) ; port 1V2_IN
MINER_CLK: Y1.3(OUT) ; port CLK_OUT
NetR9_1: R9.1 Y1.1(Tri-State)

### Library data of the parts
C10 = CMP-001-00094-1: as C21 on sheet Fan; Category: Capacitor; Price: 0.004; Package: 0402; MOQ: 10000
R9 = CMP-x00147-1: as R76 on sheet 1V2-BUCK
Y1 = CMP-x00169-1: Xtal Osc Xo 25MHZ 1.2V Cmos SMD

## Sheet ESP32.SchDoc
size A3; SheetNumber: 3; SheetTotal: 16
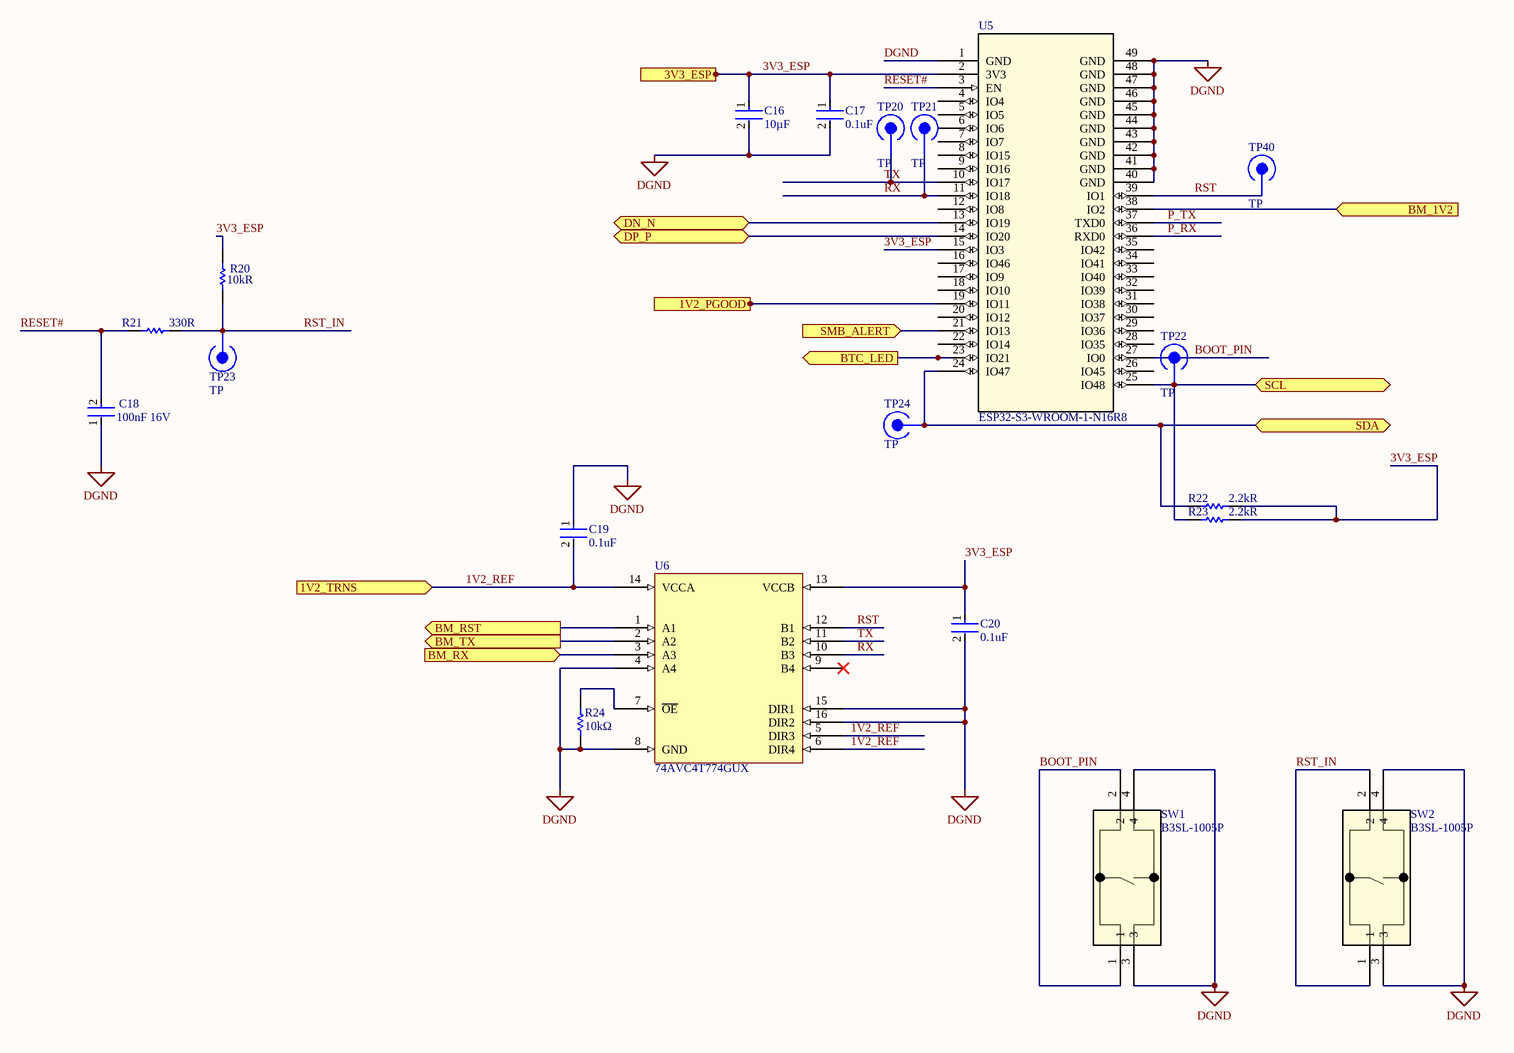
[diagram p8: ESP32.SchDoc]

### Parts
C16  value 10µF  [FP-GRM21B-0_15-MFG]  (hidden comment: GRM21BR61E106KA73L)
C17  value 0.1uF  [FP-CC0402-IPC_C]  (hidden comment: CC0402KRX7R7BB104)
C18  value 100nF  Rating: 16V  [FP-GRM15-MFG]  (hidden comment: GRM155R71C104KA88D)
C19  value 0.1uF  [FP-CC0402-IPC_C]  (hidden comment: CC0402KRX7R7BB104)
C20  value 0.1uF  [FP-CC0402-IPC_C]  (hidden comment: CC0402KRX7R7BB104)
R20  value 10kR  [RESC1005X40X25LL10T10]  (hidden comment: RK73H1ETTP1002F)
R21  value 330R  [RESC1005X40X25ML10T10]  (hidden comment: RK73H1ETTP3300F)
R22  value 2.2kR  [RESC1005X40X25NL10T10]  (hidden comment: RK73H1ETTP2201F)
R23  value 2.2kR  [RESC1005X40X25NL10T10]  (hidden comment: RK73H1ETTP2201F)
R24  value 10kΩ  [RESC1005X40X25LL10T10]  (hidden comment: RK73B1ETTP103J)
SW1  B3SL-1005P  [SW_B3SL-1002P_OMR]
SW2  B3SL-1005P  [SW_B3SL-1002P_OMR]
TP20  TP  [TP-Footprint-1]
TP21  TP  [TP-Footprint-1]
TP22  TP  [TP-Footprint-1]
TP23  TP  [TP-Footprint-1]
TP24  TP  [TP-Footprint-1]
TP40  TP  [TP-Footprint-1]
U5  ESP32-S3-WROOM-1-N16R8  [ESP32-S3-WROOM-1-N16R8-Footprint-1]
U6  74AVC4T774GUX  [74AVC4T774GUX-Footprint-1]

### Ports
1V2_PGOOD (in), 1V2_TRNS (in), 3V3_ESP (in), BM_1V2 (in), BM_RST (out), BM_RX (in), BM_TX (out), BTC_LED (out), DN_N (bidir), DP_P (bidir), SCL (bidir), SDA (bidir), SMB_ALERT (in)

### Nets
3V3_ESP: C16.1 C17.1 C20.1 R20.2 R22.2 R23.2 U5.2(3V3) U5.15(IO3) U6.13(VCCB) ; port 3V3_ESP
DGND: C16.2 C17.2 C18.1 C19.1 C20.2 R24.2 SW1.3 SW1.4 SW2.3 SW2.4 U5.1(GND) U5.40(GND) U5.41(GND) U5.42(GND) U5.43(GND) U5.44(GND) U5.45(GND) U5.46(GND) U5.47(GND) U5.48(GND) U5.49(GND) U6.4(A4) U6.8(GND) U6.15(DIR1) U6.16(DIR2)
1V2_REF: C19.2 U6.5(DIR3) U6.6(DIR4) U6.14(VCCA) ; port 1V2_TRNS  [project net 1V2]
BOOT_PIN: SW1.1 SW1.2 U5.27(IO0)
MINER_RST: U6.1(A1) ; port BM_RST
MINER_RX: U6.3(A3) ; port BM_RX
MINER_TX: U6.2(A2) ; port BM_TX
P_RX: U5.36(RXD0)
P_TX: U5.37(TXD0)
PG_ESP: U5.19(IO11) ; port 1V2_PGOOD
RESET#: C18.2 R21.1 U5.3(EN)
RST: TP40.1 U5.39(IO1) U6.12(B1)
RST_IN: R20.1 R21.2 SW2.1 SW2.2 TP23.1
RX: TP21.1 U5.11(IO18) U6.10(B3)
SCL: R23.1 TP22.1 U5.25(IO48) ; port SCL
SDA: R22.1 TP24.1 U5.24(IO47) ; port SDA
SMB: U5.21(IO13) ; port SMB_ALERT
TX: TP20.1 U5.10(IO17) U6.11(B2)
USB_N: U5.13(IO19) ; port DN_N
USB_P: U5.14(IO20) ; port DP_P
VCORE: U5.38(IO2) ; port BM_1V2
NetR24_1: R24.1 U6.7(~{OE})
NetU5_23: U5.23(IO21) ; port BTC_LED

Not connected (* = marked no-connect by the designer): U5 4(IO4) 5(IO5) 6(IO6) 7(IO7) 8(IO15) 9(IO16) 12(IO8) 16(IO46) 17(IO9) 18(IO10) 20(IO12) 22(IO14) 26(IO45) 28(IO35) 29(IO36) 30(IO37) 31(IO38) 32(IO39) 33(IO40) 34(IO41) 35(IO42); U6 9(B4)*

### Library data of the parts
C16 = CMP-001-00145-3: Ceramic Capacitor, Multilayer, Ceramic, 25V, 10% +Tol, 10% -Tol, X5R, 15% TC, 10uF, Surface Mount, 0805; Manufacturer: Murata; Reel Size: 8mm; Vendor: TTI; Template: MR_0805; Category: Capacitor; Price: 0.067; MOQ: 3000; Rating: 25V; Mounting: SMT; Package: 0805
C17 C19 C20 = CMP-001-00094-1: as C21 on sheet Fan; Category: Capacitor; Price: 0.004; Package: 0402; MOQ: 10000
C18 = CMP-001-00203-2: Ceramic Capacitor, Multilayer, Ceramic, 16V, 10% +Tol, 10% -Tol, X7R, 15% TC, 0.1uF, Surface Mount, 0402; Manufacturer: Murata; Reel Size: 8mm; Vendor: TTI; Template: MR_0402; Price Floor: 0.00317; MOQ: 10000; Price Floor Quantity: 750000; Category: Capacitor; Price @ MOQ: 0.003; Mounting: SMT; Case/Package: 0402; Design Item ID: CMP-00123-1; Source: Components - 07.02.25 - 13.24.SchLib
R20 = CMP-x00150-1: as R5 on sheet BM1370
R21 = CMP-2002-04371-1: Manufacturer: KOA Speer; Part Number: RK73H1ETTP3300F
R22 R23 = CMP-2002-03812-1: Manufacturer: KOA Speer; Part Number: RK73H1ETTP2201F
R24 = CMP-009-00227-1: as R27 on sheet Fan; Package: 0402; Price: 0.0017; Category: Resistor
SW1 SW2 = CMP-011-00029-1: No Description Available; Mfr_Name: Omron; Pins: 4; Design Item ID: B3SL-1005P; Component Type: Standard; Type: Type; RefDes: RefDes; Source: B3SL-1005P.SchLib
TP20-TP24 TP40 = CMP-001-0086-3: digital shovel test point
U5 = CMP-226-000000-01-A-2: No Description Available; Mfr_Name: Espressif Systems; Type: Type; Component Type: Standard; Design Item ID: ESP32-S3-WROOM-1-N16R8; Pin Count: 49; RefDes: RefDes; Source: ESP32-S3-WROOM-1-N16R8.SchLib
U6 = CMP-x00133-2: 74AVC4T774 - 4-bit dual supply translating transceiver; 3-state; Manufacturer: Nexperia; Template: NX_XQFN_16; Reel Width: 8mm; Vendor: TTI; MOQ: 4000; Mounting: SMT; Price: 0.301; Package: XQFN_16; Category: Integrated Circuit

## Sheet MISC.SchDoc
size A4; SheetNumber: 7; SheetTotal: 16
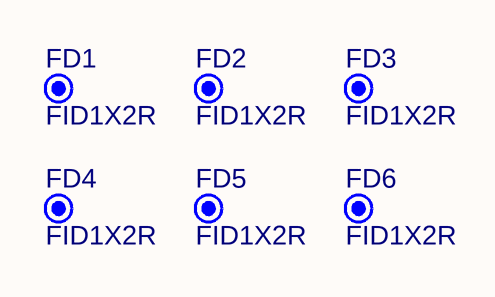
[diagram p9: MISC.SchDoc]

### Parts
FD1  FID1X2R  [FID1X2R]  (no BOM)
FD2  FID1X2R  [FID1X2R]  (no BOM)
FD3  FID1X2R  [FID1X2R]  (no BOM)
FD4  FID1X2R  [FID1X2R]  (no BOM)
FD5  FID1X2R  [FID1X2R]  (no BOM)
FD6  FID1X2R  [FID1X2R]  (no BOM)

### Library data of the parts
FD1-FD6 = CMP-00028-00005-4: Fiducial - Round 1x2mm; Pins: 0

## Sheet LOGIC_SUPPLY.SchDoc
size A4; SheetNumber: 13; SheetTotal: 17
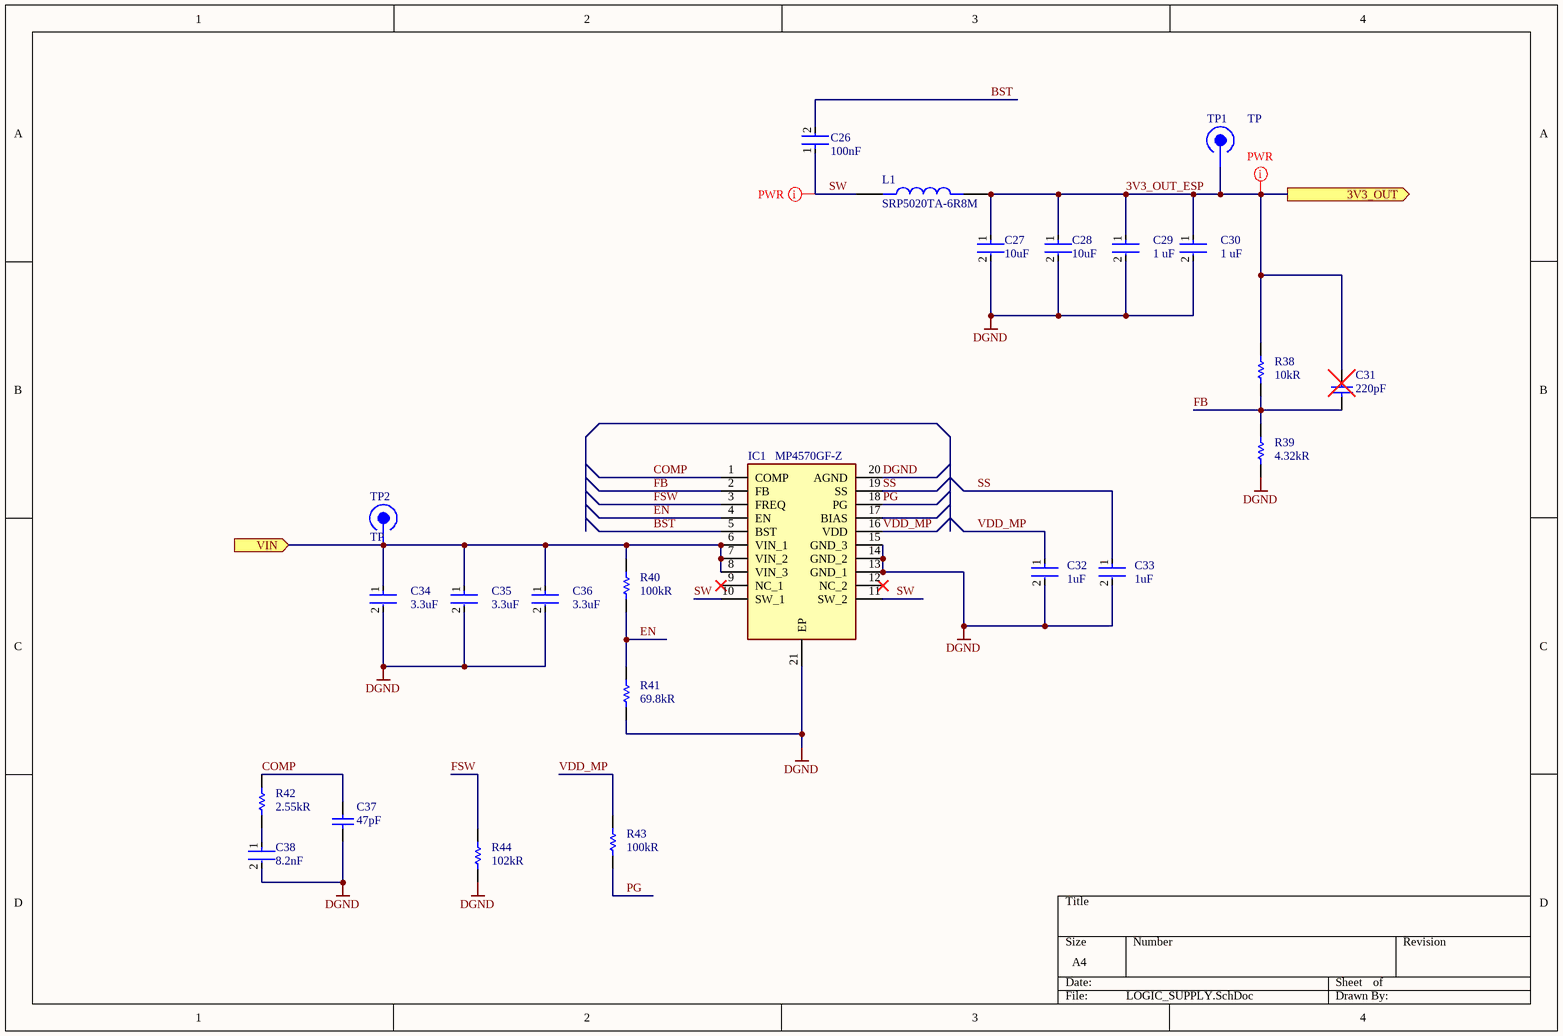
[diagram p10: LOGIC_SUPPLY.SchDoc]

### Parts
C26  value 100nF  [FP-CC0402-IPC_B]  (hidden comment: CC0402KRX7R9BB104)
C27  value 10uF  [FP-GRM21B-0_15-MFG]  (hidden comment: GRM21BR71A106KA73L)
C28  value 10uF  [FP-GRM21B-0_15-MFG]  (hidden comment: GRM21BR71A106KA73L)
C29  value 1 uF  [FP-CC0402-MFG]  (hidden comment: CC0402KRX5R6BB105)
C30  value 1 uF  [FP-CC0402-MFG]  (hidden comment: CC0402KRX5R6BB105)
C31  value 220pF  [CAPC1005X55X25LL05T10]  (hidden comment: GRM1555C1H221GA01J)  (no BOM)
C32  Capacitance: 1uF  [FP-GRM155-0_05-IPC_B]  (hidden comment: GRM155R61E105KA12D)
C33  Capacitance: 1uF  [FP-GRM155-0_05-IPC_B]  (hidden comment: GRM155R61E105KA12D)
C34  value 3.3uF  [FP-C2012-125-0_2-MFG]  (hidden comment: C2012X7R1E335K125AB)
C35  value 3.3uF  [FP-C2012-125-0_2-MFG]  (hidden comment: C2012X7R1E335K125AB)
C36  value 3.3uF  [FP-C2012-125-0_2-MFG]  (hidden comment: C2012X7R1E335K125AB)
C37  value 47pF  [CAPC1005X55X25LL05T10]  (hidden comment: GRM1555C1H470GA01D)
C38  value 8.2nF  [FP-GRM155-0_15-IPC_C]  (hidden comment: GRM1555C1H822JE01D)
IC1  MP4570GF-Z  [MP4570GF-Z-Footprint-1]
L1  SRP5020TA-6R8M  [SRP5020TA-6R8M-Footprint-1]
R38  value 10kR  [RESC1005X40X25LL10T10]  (hidden comment: RK73H1ETTP1002F)
R39  value 4.32kR  [RESC1005X40X25LL10T10]  (hidden comment: RK73H1ETTP4321F)
R40  value 100kR  [RESC1005X40X25NL10T10]  (hidden comment: RK73H1ETTP1003F)
R41  value 69.8kR  [RESC1005X40X25NL10T10]  (hidden comment: RK73H1ETTP6982F)
R42  value 2.55kR  [RESC1005X40X25ML10T10]  (hidden comment: RK73H1ETTP2551F)
R43  value 100kR  [RESC1005X40X25LL10T10]  (hidden comment: RK73H1ETTP1003F)
R44  value 102kR  [RESC1005X40X25ML10T10]  (hidden comment: RK73H1ETTP1023F)
TP1  TP  [TP-Footprint-1]
TP2  TP  [TP-Footprint-1]

### Ports
3V3_OUT (out), VIN (in)

### Nets
3V3_OUT_ESP: C27.1 C28.1 C29.1 C30.1 C31.2 L1.2 R38.2 TP1.1 ; port 3V3_OUT  [project net 3V3_ESP]
DGND: C27.2 C28.2 C29.2 C30.2 C32.2 C33.2 C34.2 C35.2 C36.2 C37.1 C38.2 IC1.13(GND_1) IC1.14(GND_2) IC1.15(GND_3) IC1.20(AGND) IC1.21(EP) R39.1 R41.1 R44.1
3V3_IN: C34.1 C35.1 C36.1 IC1.6(VIN_1) IC1.7(VIN_2) IC1.8(VIN_3) R40.2 TP2.1 ; port VIN
BST: C26.2 IC1.5(BST)
COMP: C37.2 IC1.1(COMP) R42.2
EN: IC1.4(EN) R40.1 R41.2
FB: C31.1 IC1.2(FB) R38.1 R39.2
FSW: IC1.3(FREQ) R44.2
PG: IC1.18(PG) R43.1
SS: C33.1 IC1.19(SS)
SW: C26.1 IC1.10(SW_1) IC1.11(SW_2) L1.1
VDD_MP: C32.1 IC1.16(VDD) R43.2
NetC38_1: C38.1 R42.1

Not connected (* = marked no-connect by the designer): IC1 9(NC_1)* 12(NC_2)* 17(BIAS)

### Layout directives
net class PWR: 3V3_ESP, SW

### Library data of the parts
C26 = CMP-x00152-1: as C55 on sheet 1V2-BUCK
C27 C28 = CMP-x00157-1: as C73 on sheet 1V2-BUCK
C29 C30 = CMP-03422-000489-1: as C67 on sheet 1V2-BUCK; Device Class L1: Passive Components; Ipc Land Pattern Name: CAPC10050X50; Height: 0.55mm; Voltage Rating: 10 V; Digikey Description: CAP CER 1UF 10V X5R 0402; RoHS: TRUE; Temperature: -55°C to +125°C; Octopart: https://octopart.com/cc0402krx5r6bb105-yageo-42244620; Mouser Description: Multilayer Ceramic Capacitors MLCC - SMD/SMT 1uF 10V X5R 10%; Manufacturer Part Number: CC0402KRX5R6BB105; Temperature Characteristic: X5R; Category: Cap; Automotive: No; Temperature Range Low: -55°C; ComponentLink2Description: Datasheet; Temperature Range High: +125°C; Package: CC0402; Capacitance: 1 uF; Footprint Url: http://www.yageo.com/exep/pages/download/literatures/UPY-C_GEN_24.pdf; ComponentLink2URL: http://www.yageo.com/documents/recent/UPY-GP_NP0_16V-to-50V_16.pdf; Lead Free: Yes; Device Class L3: Ceramic Capacitors; Device Class L2: Capacitors
C31 = CMP-2008-04169-1: Manufacturer: Murata; Part Number: GRM1555C1H221GA01J
C32 C33 = CMP-2008-04581-2: Chip Multilayer Ceramic Capacitors for General Purpose, 0402, 1.0uF, X5R, 15%, 10%, 25V; Height: 0.5mm; Voltage: 25V; Tolerance: 10%; Termination: SMD/SMT; Dielectric: X5R; REACH SVHC: No SVHC; Case Code (Imperial): 0402; Max Operating Temperature: 85°C; Lead Free: Lead Free; Case/Package: 0402; Mount: Surface Mount; Width: 0.5mm; Weight: 0.000212oz; Min Operating Temperature: -55°C; Voltage Rating (DC): 25V; Length: 1mm; Thickness: 0.022inch; Voltage Rating: 25V; Material: Ceramic; Case Code (Metric): 1005; Package Quantity: 10000; Packaging: Tape and Reel; Depth: 0.5mm
C34-C36 = CMP-08246-006023-1: Multilayer Ceramic Capacitors 3.3μF ±10% 25V X7R SMD 0805; Height: 1.25mm; Resistor Type: Ceramic; Width: 0.049inch; Length: 2mm; Series: C; Weight: 0.000194oz; Mount: Surface Mount; Tolerance: 10%; Construction: Flat; Case Code (Imperial): 0805; Voltage Rating (DC): 25V; Package Quantity: 1; Lead Free: Lead Free; Voltage Rating: 25V; RoHS Compliant: Yes; Radiation Hardening: No; Case Code (Metric): 2012; REACH SVHC: No SVHC; Dielectric Material: Ceramic; Depth: 1.25mm; Packaging: Tape and Reel; Min Operating Temperature: -55°C; Thickness: 0.057inch; Max Operating Temperature: 125°C; Termination: SMD/SMT; Dielectric: X7R; Case/Package: 0805
C37 = CMP-2008-04366-1: Manufacturer: Murata; Part Number: GRM1555C1H470GA01D
C38 = CMP-06035-016894-1: Chip Multilayer Ceramic Capacitors for General Purpose, 0402, 8200pF, C0G, 30ppm/°C, 5%, 50V
IC1 = CMP-001-0077-1: Switching Voltage Regulators 3A,4.5V-55V Input, Freqcy Programmable; Vendor: Mouser; Category: Integrated Circuit; Package: TSSOP-EP-20; Price: $2.09
L1 = CMP-x00175-1: General Purpose Inductor, 6.8uH, 20%, 1 Element, Metal Alloy Powder-Core, SMD, 2220; Value: 6.8uH
R38 = CMP-x00150-1: as R5 on sheet BM1370
R39 = CMP-2002-04376-1: Part Number: RK73H1ETTP33R2F; Manufacturer: KOA Speer
R40 R43 = CMP-x00162-1: as R48 on sheet USB-PD
R41 = CMP-2002-04506-1: Manufacturer: KOA Speer; Part Number: RK73H1ETTP6982F
R42 = CMP-2002-04318-1: Manufacturer: KOA Speer; Part Number: RK73H1ETTP2551F
R44 = CMP-2002-04177-1: Manufacturer: KOA Speer; Part Number: RK73H1ETTP1023F
TP1 TP2 = CMP-001-0086-3: digital shovel test point

## Sheet DISPLAY.SchDoc
size A4; SheetNumber: 11; SheetTotal: 16
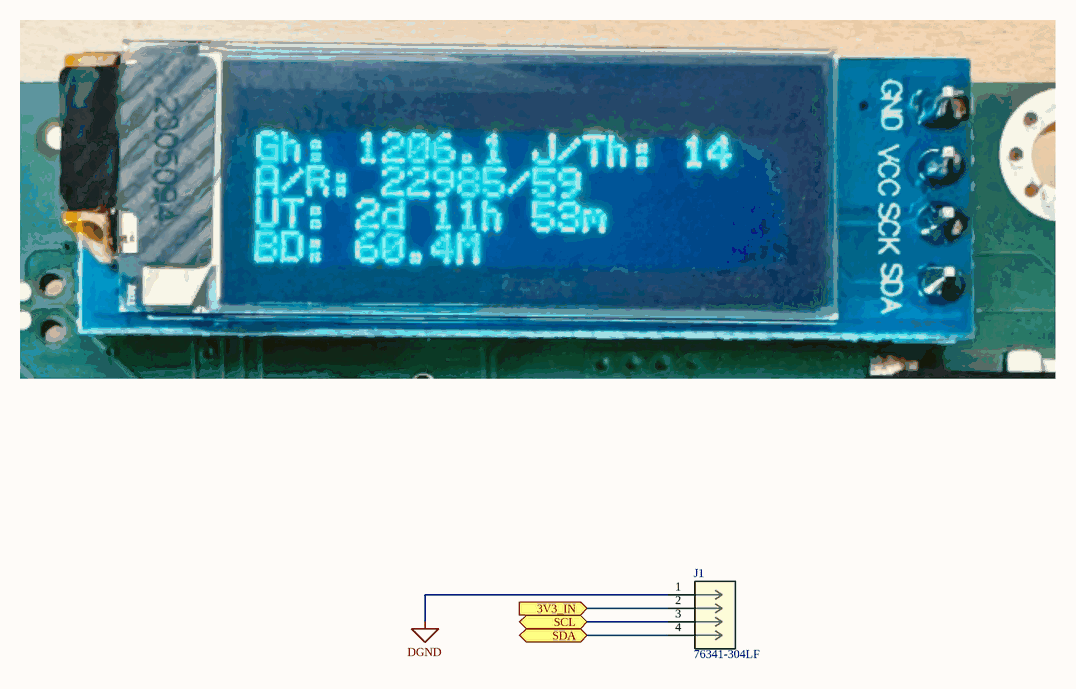
[diagram p11: DISPLAY.SchDoc]

### Parts
J1  76341-304LF  [76341-304LF-Footprint-1]

### Ports
3V3_IN (in), SCL (bidir), SDA (bidir)

### Nets
3V3_ESP: J1.2 ; port 3V3_IN
DGND: J1.1
SCL: J1.3 ; port SCL
SDA: J1.4 ; port SDA

### Library data of the parts
J1 = CMP-x00140-1